# Altium project CAN_PDM.PrjPcb (part 1 of 2)
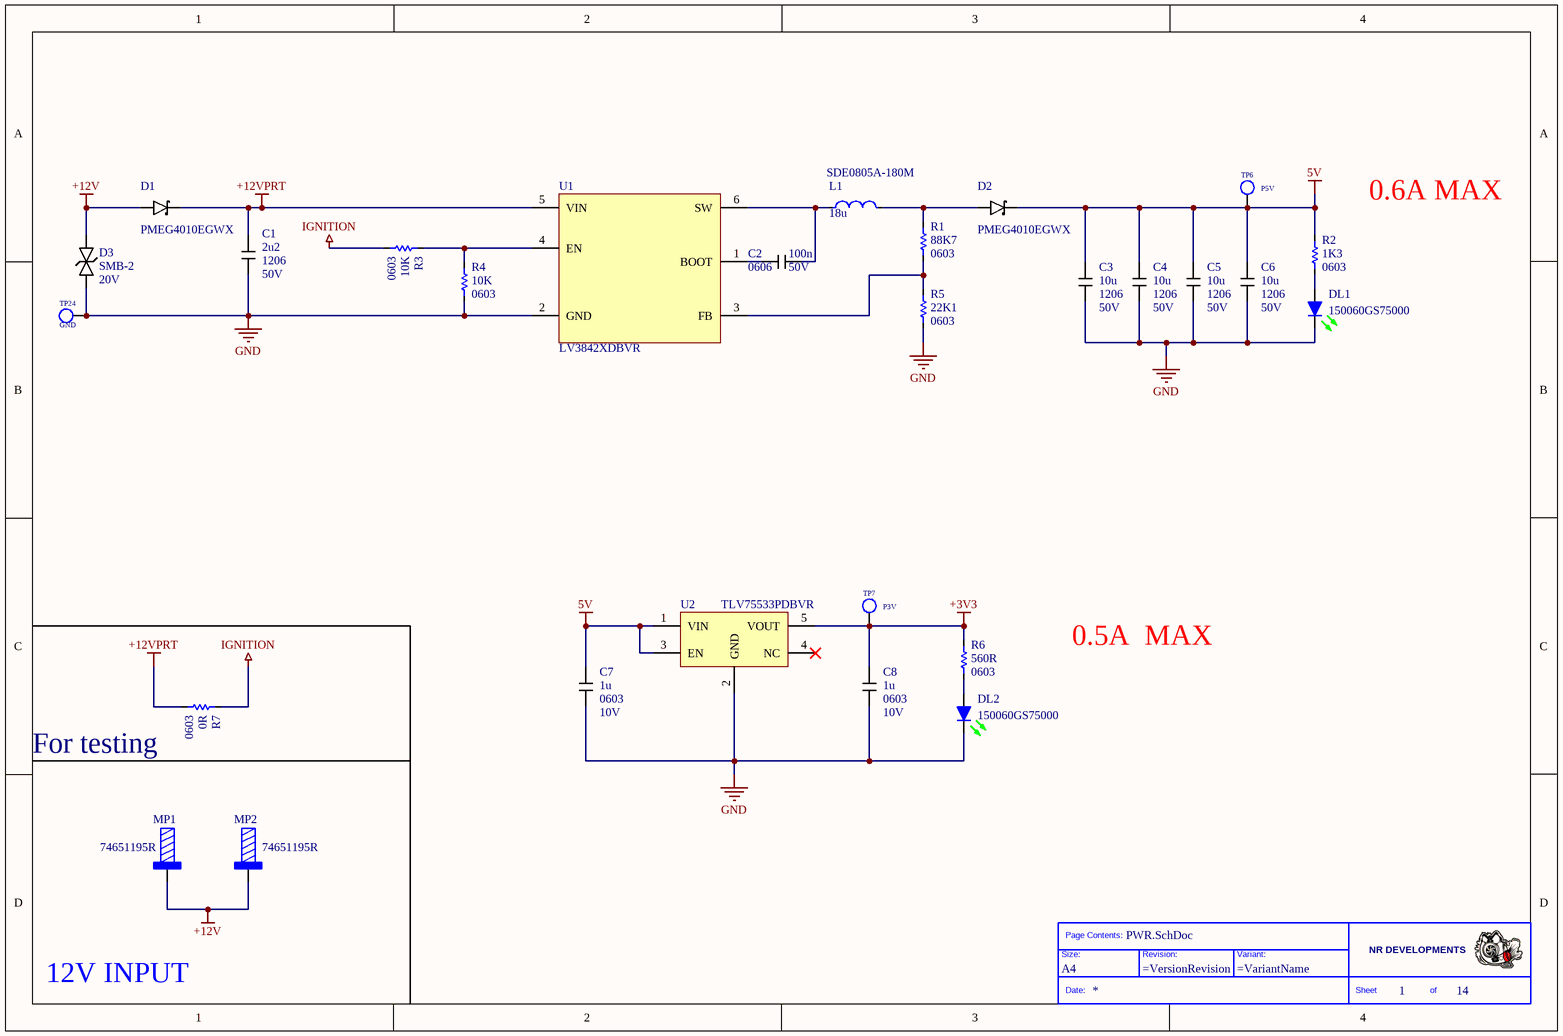
[diagram p0: PWR.SchDoc]
14 sheets, 327 parts. Net scope: flat (ports and power ports of the same name join across sheets).
Board file: CAN_PDM_Pcb.PcbDoc
Sheets:
  PWR.SchDoc
  MCU.SchDoc
  USB.SchDoc
  CAN.SchDoc
  HIGH_CURR_MOS.SchDoc
  HIGH_CURR_MOS2.SchDoc
  MID_CURR_MOS.SchDoc
  LOW_CURR_MOS.SchDoc
  SENSOR_INP.SchDoc
  DIGITAL_INP.SchDoc
  I2C.SchDoc
  LED_STATUS_OUTPUTS.SchDoc
  LED_STATUS_INPUT.SchDoc
  CONNECTOR.SchDoc

## Sheet PWR.SchDoc
size A4; SheetNumber: 1; SheetTotal: 14

### Parts
(Parts that share a designator on the sheet are numbered #1, #2 ... from top to bottom, then left to right.)
*#1  Size: A4  (hidden comment: Title_Block)  (graphical)
C1  value 2u2  Case: 1206  Voltage: 50V  [CAPC3216X16M]  (hidden comment: CAP)
C2  value 100n  Case: 0606  Voltage: 50V  [CAPC1608X09M]  (hidden comment: CAP)
C3  value 10u  Case: 1206  Voltage: 50V  [CAPC3216X16M]  (hidden comment: CAP)
C4  value 10u  Case: 1206  Voltage: 50V  [CAPC3216X16M]  (hidden comment: CAP)
C5  value 10u  Case: 1206  Voltage: 50V  [CAPC3216X16M]  (hidden comment: CAP)
C6  value 10u  Case: 1206  Voltage: 50V  [CAPC3216X16M]  (hidden comment: CAP)
C7  value 1u  Case: 0603  Voltage: 10V  [CAPC1608X09M]  (hidden comment: CAP)
C8  value 1u  Case: 0603  Voltage: 10V  [CAPC1608X09M]  (hidden comment: CAP)
D1  value PMEG4010EGWX  [SODFL360X130-2M -AC]  (hidden comment: Diode_Schottky)
D2  value PMEG4010EGWX  [SODFL360X130-2M -AC]  (hidden comment: Diode_Schottky)
D3  Case: SMB-2  Voltage: 20V  [ONSC-SMB-2]  (hidden comment: Diode)
DL1  value 150060GS75000  [LED0603]  (hidden comment: LED_Green)
DL2  value 150060GS75000  [LED0603]  (hidden comment: LED_Green)
L1  value 18u  PartNumber: SDE0805A-180M  [BOURNS_SDE0805A]  (hidden comment: IND)
MP1  value 74651195R  [WURTH_74651195]  (hidden comment: Connector)
MP2  value 74651195R  [WURTH_74651195]  (hidden comment: Connector)
R1  value 88K7  Case: 0603  [RESC1608X06M]  (hidden comment: Res)
R2  value 1K3  Case: 0603  [RESC1608X06M]  (hidden comment: Res)
R3  value 10K  Case: 0603  [RESC1608X06M]  (hidden comment: Res)
R4  value 10K  Case: 0603  [RESC1608X06M]  (hidden comment: Res)
R5  value 22K1  Case: 0603  [RESC1608X06M]  (hidden comment: Res)
R6  value 560R  Case: 0603  [RESC1608X06M]  (hidden comment: Res)
R7  value 0R  Case: 0603  [RESC1608X06M]  (hidden comment: Res)
TP6  P5V  [TP_c200]
TP7  P3V  [TP_c200]
TP24  GND  [TP_c200]
U1  value LV3842XDBVR  [SOT95P280X145-6N]  (hidden comment: DC DC)
U2  value TLV75533PDBVR  [SOT95P280X145-5N]  (hidden comment: TLV75530PDBVR)

### Nets
5V: C3.1 C4.1 C5.1 C6.1 C7.1 D2.C R2.2 TP6.1 U2.1(VIN) U2.3(EN)
+3V3: C8.1 R6.2 TP7.1 U2.5(VOUT)
+12V: D1.A D3.2 MP1.1 MP2.1
+12VPRT: C1.1 D1.C R7.1 U1.5(VIN)
GND: C1.2 C3.2 C4.2 C5.2 C6.2 C7.2 C8.2 D3.1 DL1.C DL2.C R4.1 R5.1 TP24.1 U1.2(GND) U2.2(GND)
IGNITION: R3.1 R7.2
NetC2_1: C2.1 U1.1(BOOT)
NetC2_2: C2.2 L1.1 U1.6(SW)
NetD2_A: D2.A L1.2 R1.2
NetDL1_A: DL1.A R2.1
NetDL2_A: DL2.A R6.1
NetR1_1: R1.1 R5.2 U1.3(FB)
NetR3_2: R3.2 R4.2 U1.4(EN)

Not connected (* = marked no-connect by the designer): U2 4(NC)*

### Notes on the sheet
- 0.6A MAX
- 0.5A  MAX
- (near R7) For testing
- 12V INPUT
- (in symbol Title_Block) Page Contents:; NR DEVELOPMENTS; Size:; Revision:; Variant:; Date:; Sheet; of

### Library data of the parts
C1 = CAP: Manufacturer: KEMET; PartNumber: C1206C225K5RAC
C2 = CAP: Manufacturer: KEMET; PartNumber: C0603C104K5RACTU
C3-C6 = CAP: Manufacturer: Samsung Electro-Mechanics; PartNumber: CL31B106KBHNNNE
C7 C8 = CAP: Manufacturer: KEMET; PartNumber: C0603C105K8RACTU
D1 D2 = Diode_Schottky: Manufacturer: Nexperia; PartNumber: PMEG4010EGWX; Case: SOD123
D3 = Diode_TVS_Bid: Manufacturer: Littelfuse; Value: SZ1SMB20CAT3G; PartNumber: SZ1SMB20CAT3G
DL1 DL2 = LED_Green: Manufacturer: Wurth Elektronik; Case: 0603; PartNumber: 150060GS75000
L1 = IND: Manufacturer: BOURNS; Case: SDE0805A
MP1 MP2 = 74651195R: Manufacturer: Wurth Electronics; PartNumber: 74651195R
R1 = Resistor: Manufacturer: Vishay; PartNumber: CRCW060388K7FKEAC
R2 = Resistor: Manufacturer: Vishay; PartNumber: RC0603FR-071K3L
R3 R4 = Resistor: Manufacturer: YAGEO; PartNumber: AC0603FR-0710KL
R5 = Resistor: Manufacturer: Vishay; PartNumber: CRCW060322K1FKEA
R6 = Resistor: Manufacturer: Vishay; PartNumber: RC0603FR-07560RL
R7 = Resistor: Manufacturer: YAGEO; PartNumber: RC0603JR-070RL
TP6 TP7 TP24 = Test_Point
U1 = LV3842XDBVR: 4-V to 36-V, 600-mA synchronous step-down converter; Manufacturer: Texas Instruments; PartNumber: LV3842XDBVR; Case: 6-SOT-23
U2 = TLV75530PDBVR: LDO Voltage Regulators 500-mA high-PSRR low-IQ low-dropout voltage regulator with enable; Manufacturer: Texas Instruments; PartNumber: TLV75533PDBVR; Case: SOT-23-5

## Sheet MCU.SchDoc
size A4; SheetNumber: 2; SheetTotal: 14
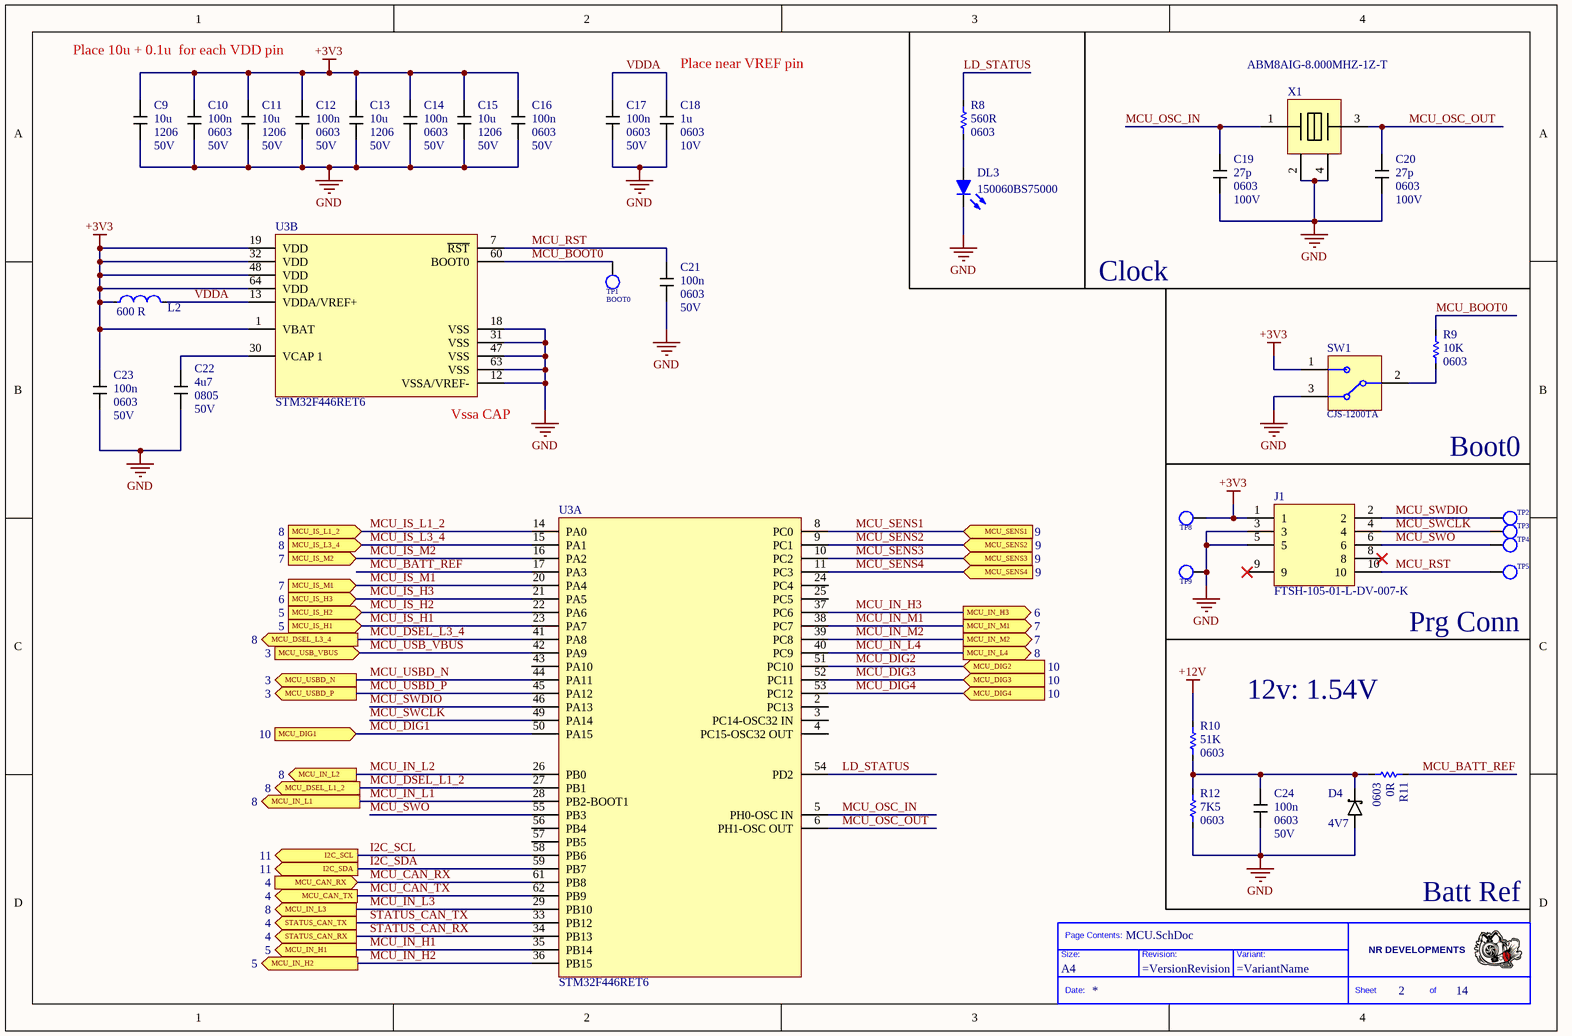
[diagram p1: MCU.SchDoc]

### Parts
(Parts that share a designator on the sheet are numbered #1, #2 ... from top to bottom, then left to right.)
*#2  Size: A4  (hidden comment: Title_Block)  (graphical)
C9  value 10u  Case: 1206  Voltage: 50V  [CAPC3216X16M]  (hidden comment: CAP)
C10  value 100n  Case: 0603  Voltage: 50V  [CAPC1608X09M]  (hidden comment: CAP)
C11  value 10u  Case: 1206  Voltage: 50V  [CAPC3216X16M]  (hidden comment: CAP)
C12  value 100n  Case: 0603  Voltage: 50V  [CAPC1608X09M]  (hidden comment: CAP)
C13  value 10u  Case: 1206  Voltage: 50V  [CAPC3216X16M]  (hidden comment: CAP)
C14  value 100n  Case: 0603  Voltage: 50V  [CAPC1608X09M]  (hidden comment: CAP)
C15  value 10u  Case: 1206  Voltage: 50V  [CAPC3216X16M]  (hidden comment: CAP)
C16  value 100n  Case: 0603  Voltage: 50V  [CAPC1608X09M]  (hidden comment: CAP)
C17  value 100n  Case: 0603  Voltage: 50V  [CAPC1608X09M]  (hidden comment: CAP)
C18  value 1u  Case: 0603  Voltage: 10V  [CAPC1608X09M]  (hidden comment: CAP)
C19  value 27p  Case: 0603  Voltage: 100V  [CAPC1608X09M]  (hidden comment: CAP)
C20  value 27p  Case: 0603  Voltage: 100V  [CAPC1608X09M]  (hidden comment: CAP)
C21  value 100n  Case: 0603  Voltage: 50V  [CAPC1608X09M]  (hidden comment: CAP)
C22  value 4u7  Case: 0805  Voltage: 50V  [CAPC2012X14N]  (hidden comment: CAP)
C23  value 100n  Case: 0603  Voltage: 50V  [CAPC1608X09M]  (hidden comment: CAP)
C24  value 100n  Case: 0603  Voltage: 50V  [CAPC1608X09M]  (hidden comment: CAP)
D4  value 4V7  [SOT65P210X100-3N - AC]  (hidden comment: Diode_Schottky)
DL3  value 150060BS75000  [LED0603]  (hidden comment: Led_Green)
J1  value FTSH-105-01-L-DV-007-K  [SAMTEC_FTSH-105-X-X-DV-007-P-X]  (hidden comment: Connector)
L2  value 600 R  [INDC1608X09N]  (hidden comment: IND)
R8  value 560R  Case: 0603  [RESC1608X06M]  (hidden comment: Res)
R9  value 10K  Case: 0603  [RESC1608X06M]  (hidden comment: Res)
R10  value 51K  Case: 0603  [RESC1608X06M]  (hidden comment: Res)
R11  value 0R  Case: 0603  [RESC1608X06M]  (hidden comment: Res)
R12  value 7K5  Case: 0603  [RESC1608X06M]  (hidden comment: Res)
SW1  value CJS-1200TA  [SW_CJS-1200TA]  (hidden comment: Switch SPDT)
TP1  BOOT0  [TP_c200]
TP2  DIO  [TP_c200]  (value not drawn)
TP3  CLK  [TP_c200]  (value not drawn)
TP4  SWO  [TP_c200]  (value not drawn)
TP5  RST  [TP_c200]  (value not drawn)
TP8  3V3  [TP_c200]  (value not drawn)
TP9  GND  [TP_c200]  (value not drawn)
U3  STM32F446RET6  [STM-LQFP64_M]  (parts A,B of 2)
X1  ABM8AIG-8.000MHZ-1Z-T  [ABM8G_abracon]

### Ports
I2C_SCL (out, see 11), I2C_SDA (out, see 11), MCU_CAN_RX (in, see 4), MCU_CAN_TX (out, see 4), MCU_DIG1 (in, see 10), MCU_DIG2 (in, see 10), MCU_DIG3 (in, see 10), MCU_DIG4 (in, see 10), MCU_DSEL_L1_2 (out, see 8), MCU_DSEL_L3_4 (out, see 8), MCU_IN_H1 (out, see 5), MCU_IN_H2 (out, see 5), MCU_IN_H3 (out, see 6), MCU_IN_L1 (out, see 8), MCU_IN_L2 (out, see 8), MCU_IN_L3 (out, see 8), MCU_IN_L4 (out, see 8), MCU_IN_M1 (out, see 7), MCU_IN_M2 (out, see 7), MCU_IS_H1 (in, see 5), MCU_IS_H2 (in, see 5), MCU_IS_H3 (in, see 6), MCU_IS_L1_2 (in, see 8), MCU_IS_L3_4 (in, see 8), MCU_IS_M1 (in, see 7), MCU_IS_M2 (in, see 7), MCU_SENS1 (in, see 9), MCU_SENS2 (in, see 9), MCU_SENS3 (in, see 9), MCU_SENS4 (in, see 9), MCU_USB_VBUS (in, see 3), MCU_USBD_N (out, see 3), MCU_USBD_P (out, see 3), STATUS_CAN_RX (out, see 4), STATUS_CAN_TX (out, see 4)

### Nets
+3V3: C9.1 C10.1 C11.1 C12.1 C13.1 C14.1 C15.1 C16.1 C23.1 J1.1 L2.1 SW1.1 TP8.1 U3.1(VBAT) U3.19(VDD) U3.32(VDD) U3.48(VDD) U3.64(VDD)
+12V: R10.2
GND: C9.2 C10.2 C11.2 C12.2 C13.2 C14.2 C15.2 C16.2 C17.2 C18.2 C19.2 C20.2 C21.2 C22.2 C23.2 C24.2 D4.A DL3.C J1.3 J1.5 R12.1 SW1.3 TP9.1 U3.12(VSSA/VREF-) U3.18(VSS) U3.31(VSS) U3.47(VSS) U3.63(VSS) X1.2 X1.4
I2C_SCL: U3.58(PB6) ; port I2C_SCL
I2C_SDA: U3.59(PB7) ; port I2C_SDA
LD_STATUS: R8.2 U3.54(PD2)
MCU_BATT_REF: R11.2 U3.17(PA3)
MCU_BOOT0: R9.2 TP1.1 U3.60(BOOT0)
MCU_CAN_RX: U3.61(PB8) ; port MCU_CAN_RX
MCU_CAN_TX: U3.62(PB9) ; port MCU_CAN_TX
MCU_DIG1: U3.50(PA15) ; port MCU_DIG1
MCU_DIG2: U3.51(PC10) ; port MCU_DIG2
MCU_DIG3: U3.52(PC11) ; port MCU_DIG3
MCU_DIG4: U3.53(PC12) ; port MCU_DIG4
MCU_DSEL_L1_2: U3.27(PB1) ; port MCU_DSEL_L1_2
MCU_DSEL_L3_4: U3.41(PA8) ; port MCU_DSEL_L3_4
MCU_IN_H1: U3.35(PB14) ; port MCU_IN_H1
MCU_IN_H2: U3.36(PB15) ; port MCU_IN_H2
MCU_IN_H3: U3.37(PC6) ; port MCU_IN_H3
MCU_IN_L1: U3.28(PB2-BOOT1) ; port MCU_IN_L1
MCU_IN_L2: U3.26(PB0) ; port MCU_IN_L2
MCU_IN_L3: U3.29(PB10) ; port MCU_IN_L3
MCU_IN_L4: U3.40(PC9) ; port MCU_IN_L4
MCU_IN_M1: U3.38(PC7) ; port MCU_IN_M1
MCU_IN_M2: U3.39(PC8) ; port MCU_IN_M2
MCU_IS_H1: U3.23(PA7) ; port MCU_IS_H1
MCU_IS_H2: U3.22(PA6) ; port MCU_IS_H2
MCU_IS_H3: U3.21(PA5) ; port MCU_IS_H3
MCU_IS_L1_2: U3.14(PA0) ; port MCU_IS_L1_2
MCU_IS_L3_4: U3.15(PA1) ; port MCU_IS_L3_4
MCU_IS_M1: U3.20(PA4) ; port MCU_IS_M1
MCU_IS_M2: U3.16(PA2) ; port MCU_IS_M2
MCU_OSC_IN: C19.1 U3.5(PH0-OSC_IN) X1.1
MCU_OSC_OUT: C20.1 U3.6(PH1-OSC_OUT) X1.3
MCU_RST: C21.1 J1.10 TP5.1 U3.7(~{RST})
MCU_SENS1: U3.8(PC0) ; port MCU_SENS1
MCU_SENS2: U3.9(PC1) ; port MCU_SENS2
MCU_SENS3: U3.10(PC2) ; port MCU_SENS3
MCU_SENS4: U3.11(PC3) ; port MCU_SENS4
MCU_SWCLK: J1.4 TP3.1 U3.49(PA14)
MCU_SWDIO: J1.2 TP2.1 U3.46(PA13)
MCU_SWO: J1.6 TP4.1 U3.55(PB3)
MCU_USB_VBUS: U3.42(PA9) ; port MCU_USB_VBUS
MCU_USBD_N: U3.44(PA11) ; port MCU_USBD_N
MCU_USBD_P: U3.45(PA12) ; port MCU_USBD_P
STATUS_CAN_RX: U3.34(PB13) ; port STATUS_CAN_RX
STATUS_CAN_TX: U3.33(PB12) ; port STATUS_CAN_TX
VDDA: C17.1 C18.1 L2.2 U3.13(VDDA/VREF+)
NetC22_1: C22.1 U3.30(VCAP_1)
NetC24_1: C24.1 D4.C R10.1 R11.1 R12.2
NetDL3_A: DL3.A R8.1
NetR9_1: R9.1 SW1.2

Not connected (* = marked no-connect by the designer): J1 8* 9*; U3 2(PC13) 3(PC14-OSC32_IN) 4(PC15-OSC32_OUT) 24(PC4) 25(PC5) 43(PA10) 56(PB4) 57(PB5)

### Notes on the sheet
- Place 10u + 0.1u  for each VDD pin
- (near C18) Place near VREF pin
- Clock
- (near U3) Vssa CAP
- Boot0
- (near TP5) Prg Conn
- 12v: 1.54V
- Batt Ref
- (in symbol Title_Block) Page Contents:; NR DEVELOPMENTS; Size:; Revision:; Variant:; Date:; Sheet; of

### Library data of the parts
C9 C11 C13 C15 = CAP: as C3 on sheet PWR
C10 C12 C14 C16 C17 C21 C23 C24 = CAP: as C2 on sheet PWR
C18 = CAP: as C7 on sheet PWR
C19 C20 = CAP: Manufacturer: YAGEO; PartNumber: CC0603FRNPO0BN270
C22 = CAP: Manufacturer: KEMET; PartNumber: C1206C475K5RACTU
D4 = Diode_Schottky: Manufacturer: Nexperia; PartNumber: BZX84W-C4V7-QX; Case: SOT323
DL3 = LED_Blue: Manufacturer: Wurth Elektronik; Case: 0603; PartNumber: 150060BS75000
J1 = FTSH-105-X-X-DV-007-P-X: Manufacturer: Samtech; PartNumber: FTSH-105-01-L-DV-007-K
L2 = IND: Manufacturer: TDK; PartNumber: MMZ1608R601ATD25; Case: 0603
R8 = Resistor: as R6 on sheet PWR
R9 = Resistor: as R3 on sheet PWR
R10 = Resistor: Manufacturer: Vishay; PartNumber: CRCW060351K0FKEA
R11 = Resistor: as R7 on sheet PWR
R12 = Resistor: Manufacturer: Vishay; PartNumber: CRCW06037K50FKEA
SW1 = SWITCH_SPDT: Manufacturer: Nidec Components; PartNumber: CJS-1200TA
TP1-TP5 TP8 TP9 = Test_Point
U3 = STM32F446RET6: IC MCU 32BIT 512KB FLASH 64LQFP; Manufacturer: ST; PartNumber: STM32F446RET6
X1 = Crystal: Manufacturer: Abracom; Value: ABM8AIG-8.000MHZ-1Z-T; PartNumber: ABM8AIG-8.000MHZ-1Z-T

## Sheet USB.SchDoc
size A4; SheetNumber: 3; SheetTotal: 14
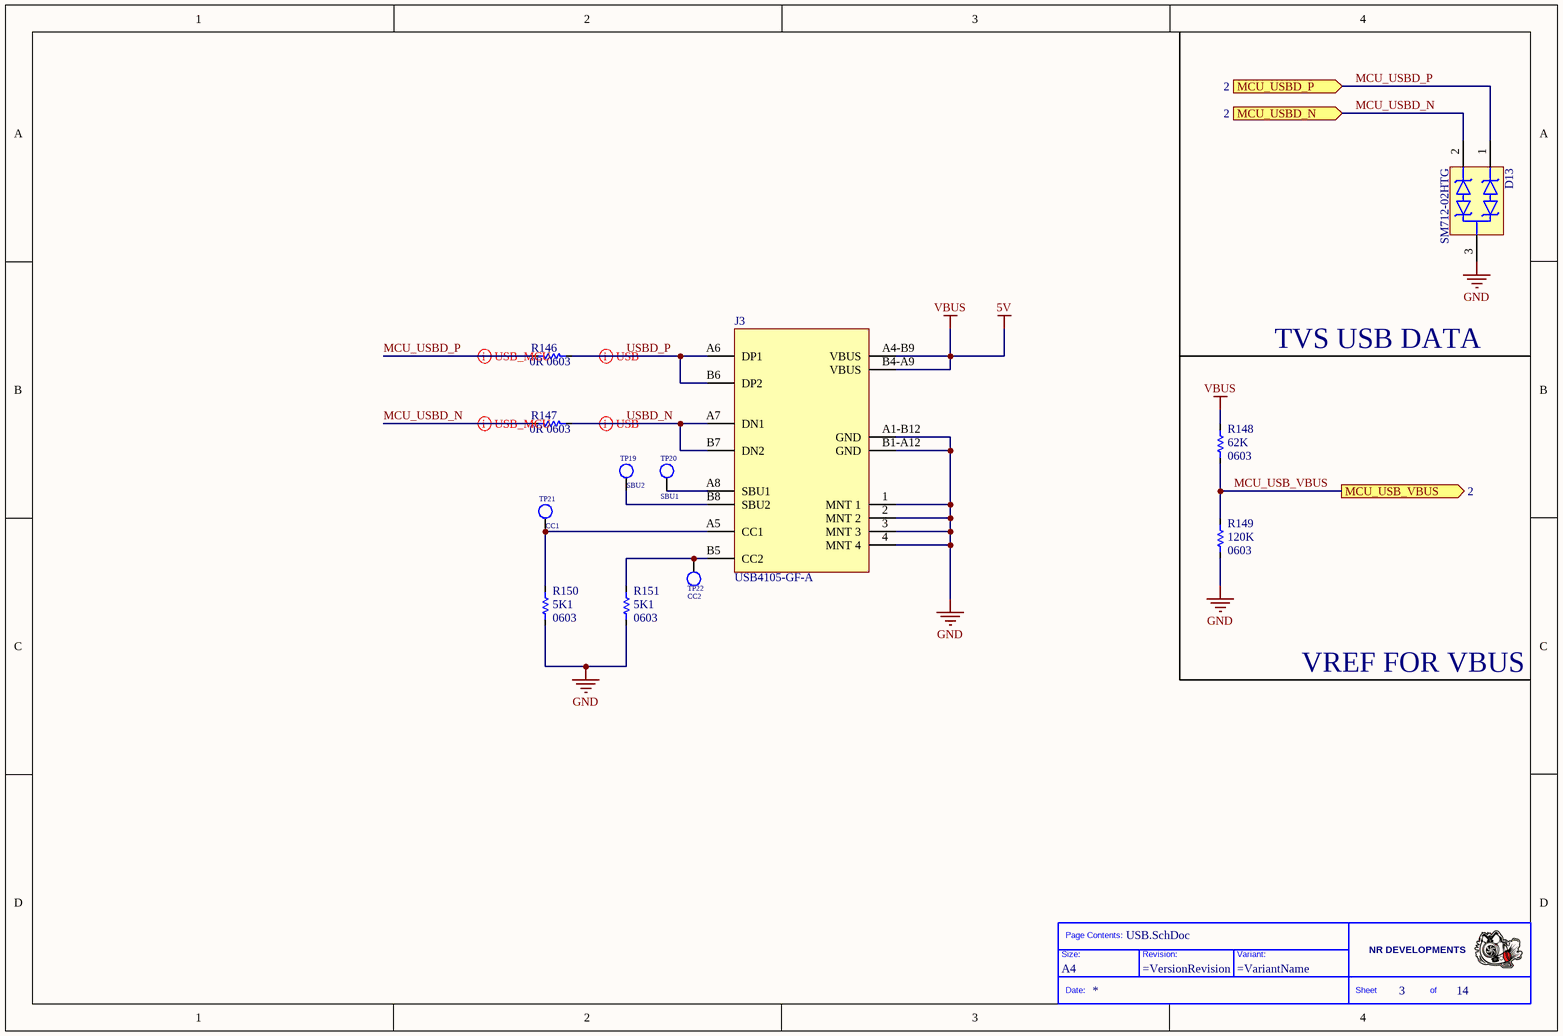
[diagram p2: USB.SchDoc]

### Parts
(Parts that share a designator on the sheet are numbered #1, #2 ... from top to bottom, then left to right.)
*#3  Size: A4  (hidden comment: Title_Block)  (graphical)
D13  SM712-02HTG  [SOT95P240X120-3N]
J3  USB4105-GF-A  [GCT-USB4105-GF-A]
R146  value 0R  Case: 0603  [RESC1608X06M]  (hidden comment: CRCW06030000Z0EAC)
R147  value 0R  Case: 0603  [RESC1608X06M]  (hidden comment: CRCW06030000Z0EAC)
R148  value 62K  Case: 0603  [RESC1608X06M]
R149  value 120K  Case: 0603  [RESC1608X06M]
R150  value 5K1  Case: 0603  [RESC1608X06M]  (hidden comment: Resistor)
R151  value 5K1  Case: 0603  [RESC1608X06M]  (hidden comment: Resistor)
TP19  SBU2  [TP_c200]
TP20  SBU1  [TP_c200]
TP21  CC1  [TP_c200]
TP22  CC2  [TP_c200]

### Ports
MCU_USB_VBUS (out, see 2), MCU_USBD_N (in, see 2), MCU_USBD_P (in, see 2)

### Nets
5V: J3.A4-B9(VBUS) J3.B4-A9(VBUS) R148.2  [also labelled VBUS]
GND: D13.3 J3.1(MNT_1) J3.2(MNT_2) J3.3(MNT_3) J3.4(MNT_4) J3.A1-B12(GND) J3.B1-A12(GND) R149.1 R150.1 R151.1
MCU_USB_VBUS: R148.1 R149.2 ; port MCU_USB_VBUS
MCU_USBD_N: D13.2 R147.1 ; port MCU_USBD_N
MCU_USBD_P: D13.1 R146.1 ; port MCU_USBD_P
USBD_N: J3.A7(DN1) J3.B7(DN2) R147.2
USBD_P: J3.A6(DP1) J3.B6(DP2) R146.2
NetJ3_A5: J3.A5(CC1) R150.2 TP21.1
NetJ3_A8: J3.A8(SBU1) TP20.1
NetJ3_B5: J3.B5(CC2) R151.2 TP22.1
NetJ3_B8: J3.B8(SBU2) TP19.1

### Layout directives
differential pair: MCU_USBD_N, MCU_USBD_P, USBD_N, USBD_P

### Notes on the sheet
- TVS USB DATA
- VREF FOR VBUS
- (in symbol Title_Block) Page Contents:; NR DEVELOPMENTS; Size:; Revision:; Variant:; Date:; Sheet; of

### Library data of the parts
D13 = SM712-02HTG: ESD Diode bid -7 to 12v; Manufacturer: Littelfuse; PartNumber: SM712-02HTG; Case: SOT23-3; Value: SM712-02HTG
J3 = USB4105-GF-A: USB Connectors USB Type C,2.0, Rec,SMT, 0.95mmTH Shell Stakes,G/F,RA,Top Mnt,T&R; Manufacturer: GCT; PartNumber: USB4105-GF-A; Value: USB4105-GF-A; Case: USB-C
R146 R147 = Resistor: as R7 on sheet PWR
R148-R151 = Resistor: Manufacturer: Vishay; PartNumber: CRCW06035K10FKEC
TP19-TP22 = Test_Point: Test Poin

## Sheet CAN.SchDoc
size A4; SheetNumber: 4; SheetTotal: 14
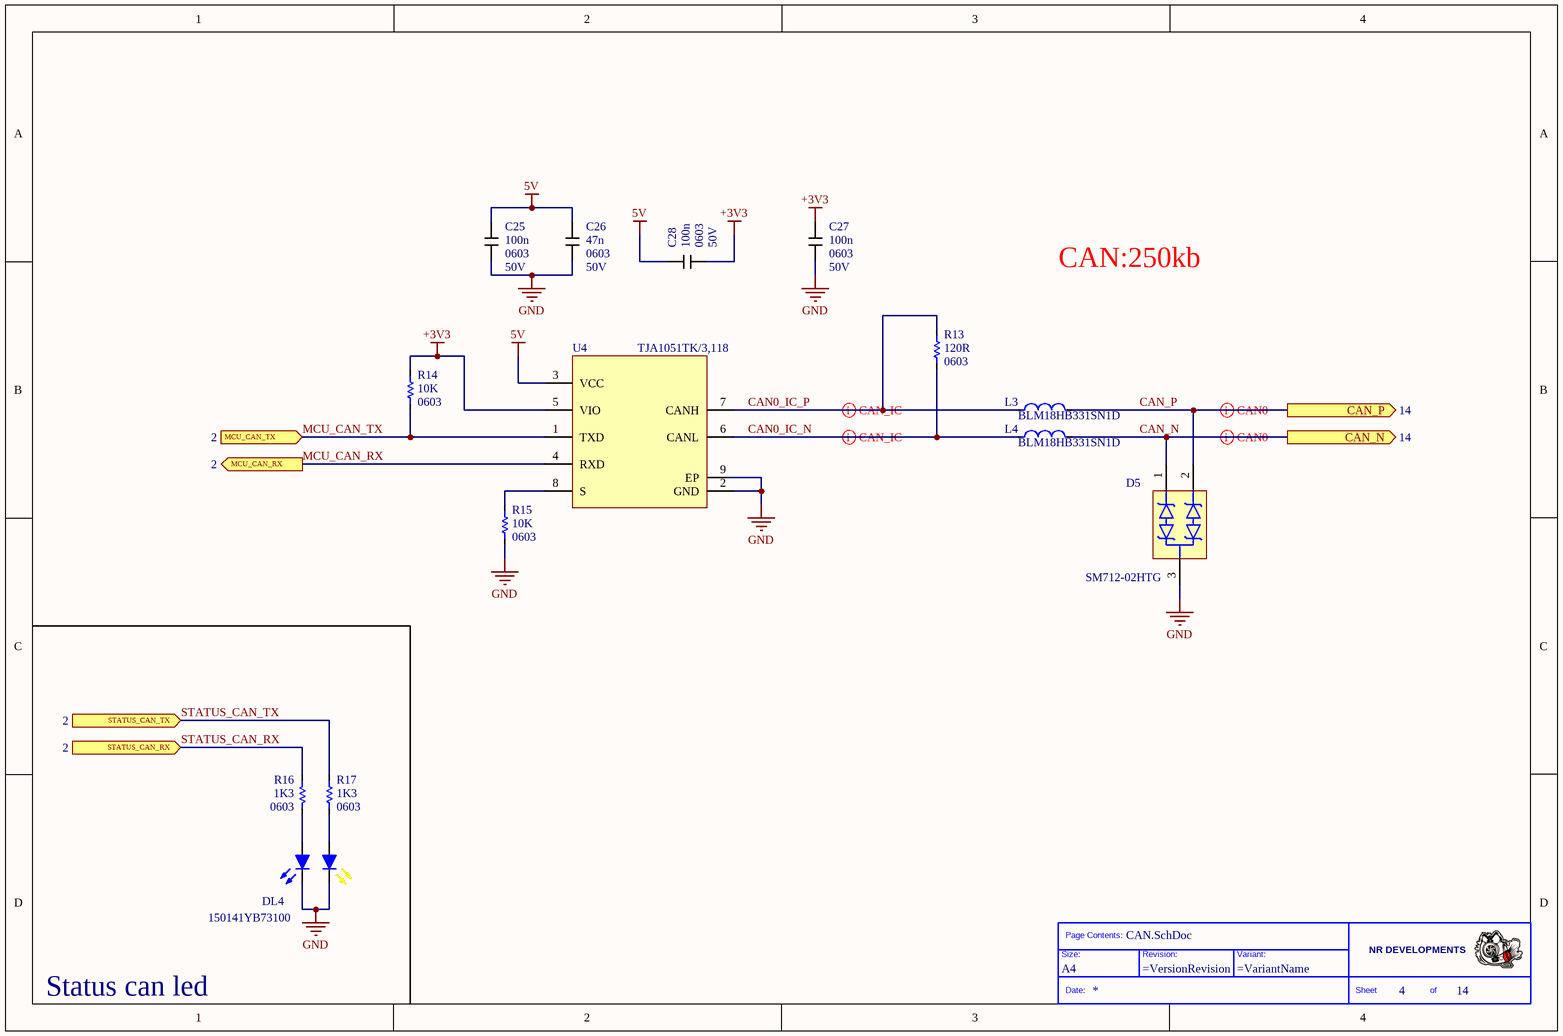
[diagram p3: CAN.SchDoc]

### Parts
(Parts that share a designator on the sheet are numbered #1, #2 ... from top to bottom, then left to right.)
*#4  Size: A4  (hidden comment: Title_Block)  (graphical)
C25  value 100n  Case: 0603  Voltage: 50V  [CAPC1608X09M]  (hidden comment: CAP)
C26  value 47n  Case: 0603  Voltage: 50V  [CAPC1608X09M]  (hidden comment: CAP)
C27  value 100n  Case: 0603  Voltage: 50V  [CAPC1608X09M]  (hidden comment: CAP)
C28  value 100n  Case: 0603  Voltage: 50V  [CAPC1608X09M]  (hidden comment: CAP)
D5  value SM712-02HTG  [SOT95P240X120-3N]  (hidden comment: ESD_Diode)
DL4  value 150141YB73100  [WURTH-SBTW_3528]  (hidden comment: LED_Yellow_Blue)
L3  value BLM18HB331SN1D  [INDC1608X09N]  (hidden comment: IND)
L4  value BLM18HB331SN1D  [INDC1608X09N]  (hidden comment: IND)
R13  value 120R  Case: 0603  [RESC1608X06M]  (hidden comment: Res)
R14  value 10K  Case: 0603  [RESC1608X06M]  (hidden comment: Res)
R15  value 10K  Case: 0603  [RESC1608X06M]  (hidden comment: Res)
R16  value 1K3  Case: 0603  [RESC1608X06M]  (hidden comment: Res)
R17  value 1K3  Case: 0603  [RESC1608X06M]  (hidden comment: Res)
U4  TJA1051TK/3,118  [SON65P300X300X100-9N-D]

### Ports
CAN_N (out, see 14), CAN_P (out, see 14), MCU_CAN_RX (out, see 2), MCU_CAN_TX (in, see 2), STATUS_CAN_RX (in, see 2), STATUS_CAN_TX (in, see 2)

### Nets
5V: C25.1 C26.1 C28.1 U4.3(VCC)
+3V3: C27.1 C28.2 R14.2 U4.5(VIO)
GND: C25.2 C26.2 C27.2 D5.3 DL4.C1 DL4.C2 R15.1 U4.2(GND) U4.9(EP)
CAN0_IC_N: L4.1 R13.1 U4.6(CANL)
CAN0_IC_P: L3.1 R13.2 U4.7(CANH)
CAN_N: D5.1 L4.2 ; port CAN_N
CAN_P: D5.2 L3.2 ; port CAN_P
MCU_CAN_RX: U4.4(RXD) ; port MCU_CAN_RX
MCU_CAN_TX: R14.1 U4.1(TXD) ; port MCU_CAN_TX
STATUS_CAN_RX: R16.2 ; port STATUS_CAN_RX
STATUS_CAN_TX: R17.2 ; port STATUS_CAN_TX
NetDL4_A1: DL4.A1 R17.1
NetDL4_A2: DL4.A2 R16.1
NetR15_2: R15.2 U4.8(S)

### Layout directives
differential pair: CAN0_IC_N, CAN0_IC_P, CAN_N, CAN_P

### Notes on the sheet
- CAN:250kb
- Status can led
- (in symbol Title_Block) Page Contents:; NR DEVELOPMENTS; Size:; Revision:; Variant:; Date:; Sheet; of

### Library data of the parts
C25 C27 C28 = CAP: as C2 on sheet PWR
C26 = CAP: Manufacturer: YAGEO; PartNumber: CC0603KRX7R9BB473
D5 = SM712-02HTG: ESD Diode bid; Manufacturer: Littelfuse; Case: SOT23-3; PartNumber: SM712-02HTG
DL4 = LED_Yellow_Blue: Led Yellow - Blue 3528; Manufacturer: Wurth; PartNumber: 150141YB73100; Case: 3528
L3 L4 = IND: Manufacturer: Murata; Case: 0603; PartNumber: BLM18HB331SN1D
R13 = Resistor: Manufacturer: Vishay; PartNumber: CRCW0603120RFKEA
R14 R15 = Resistor: as R3 on sheet PWR
R16 R17 = Resistor: as R2 on sheet PWR
U4 = TJA1051TK/3: CAN HIGH-SPEED CAN TRANSCEIVER 3.3V / 5V Pin VIO; Manufacturer: NXP Semiconductors; Value: TJA1051TK/3,118; Case: HVSON-8; PartNumber: TJA1051TK/3,118

## Sheet HIGH_CURR_MOS.SchDoc
size A4; SheetNumber: 5; SheetTotal: 14
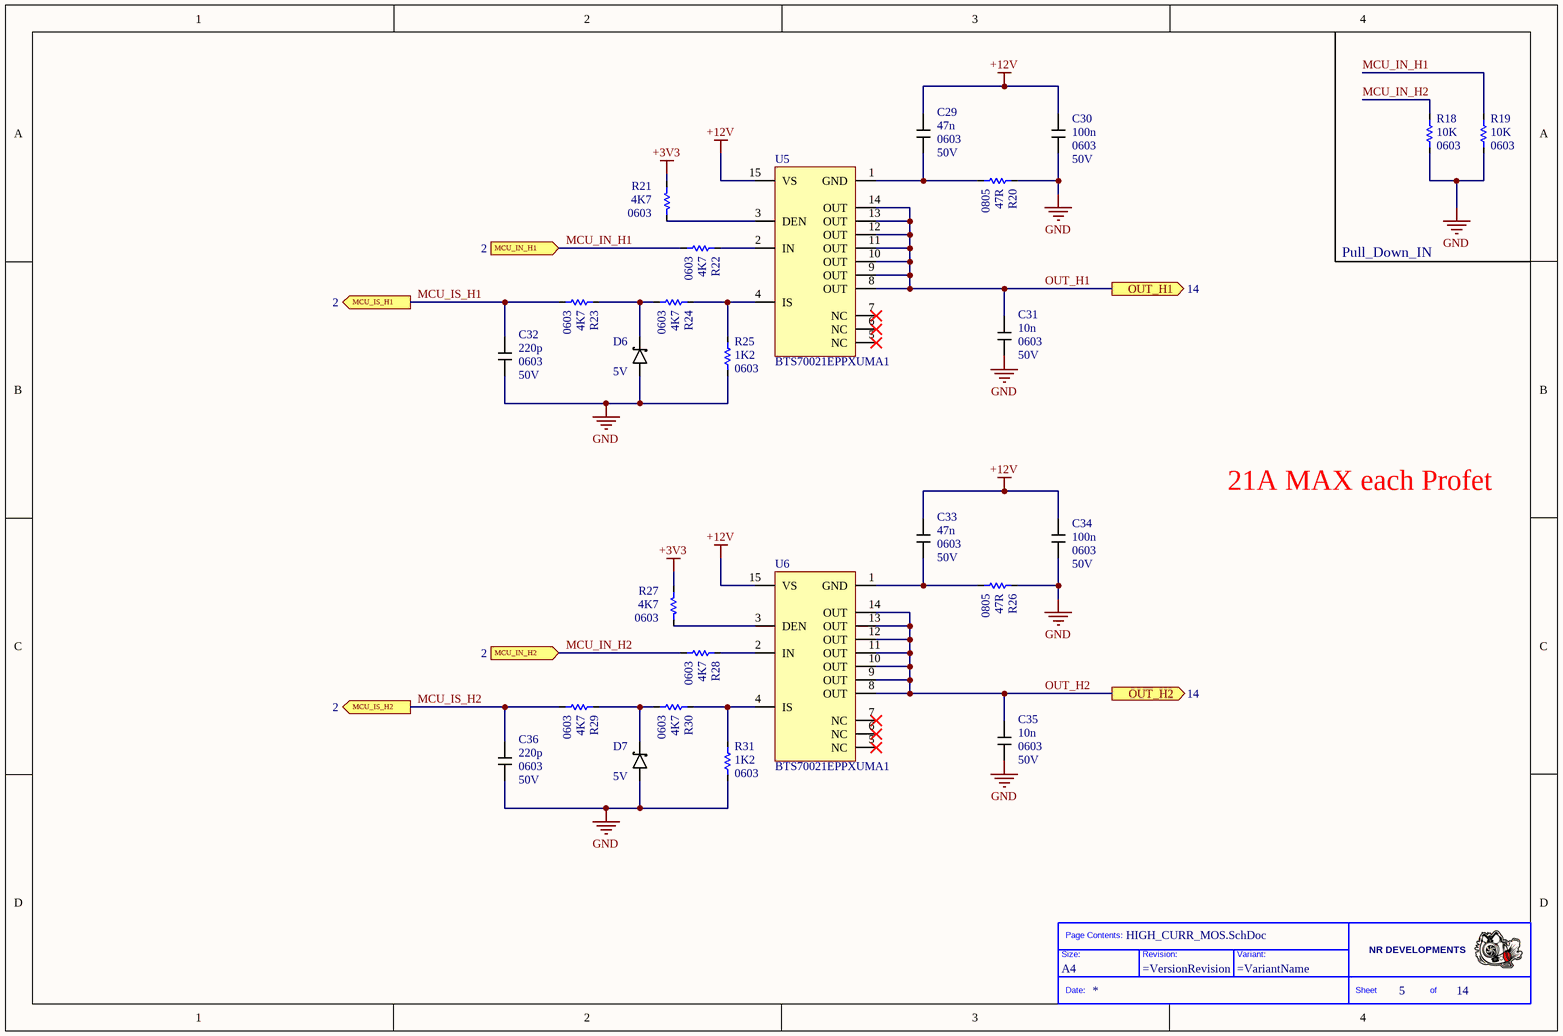
[diagram p4: HIGH_CURR_MOS.SchDoc]

### Parts
(Parts that share a designator on the sheet are numbered #1, #2 ... from top to bottom, then left to right.)
*#5  Size: A4  (hidden comment: Title_Block)  (graphical)
C29  value 47n  Case: 0603  Voltage: 50V  [CAPC1608X09M]  (hidden comment: CAP)
C30  value 100n  Case: 0603  Voltage: 50V  [CAPC1608X09M]  (hidden comment: CAP)
C31  value 10n  Case: 0603  Voltage: 50V  [CAPC1608X09M]  (hidden comment: CAP)
C32  value 220p  Case: 0603  Voltage: 50V  [CAPC1608X09M]  (hidden comment: CAP)
C33  value 47n  Case: 0603  Voltage: 50V  [CAPC1608X09M]  (hidden comment: CAP)
C34  value 100n  Case: 0603  Voltage: 50V  [CAPC1608X09M]  (hidden comment: CAP)
C35  value 10n  Case: 0603  Voltage: 50V  [CAPC1608X09M]  (hidden comment: CAP)
C36  value 220p  Case: 0603  Voltage: 50V  [CAPC1608X09M]  (hidden comment: CAP)
D6  value 5V  [SOT65P210X100-3N - AC]  (hidden comment: Diode_Schottky)
D7  value 5V  [SOT65P210X100-3N - AC]  (hidden comment: Diode_Schottky)
R18  value 10K  Case: 0603  [RESC1608X06M]  (hidden comment: Res)
R19  value 10K  Case: 0603  [RESC1608X06M]  (hidden comment: Res)
R20  value 47R  Case: 0805  [RESC2012X06N]  (hidden comment: Res)
R21  value 4K7  Case: 0603  [RESC1608X06M]  (hidden comment: Res)
R22  value 4K7  Case: 0603  [RESC1608X06M]  (hidden comment: Res)
R23  value 4K7  Case: 0603  [RESC1608X06M]  (hidden comment: Res)
R24  value 4K7  Case: 0603  [RESC1608X06M]  (hidden comment: Res)
R25  value 1K2  Case: 0603  [RESC1608X06M]  (hidden comment: Res)
R26  value 47R  Case: 0805  [RESC2012X06N]  (hidden comment: Res)
R27  value 4K7  Case: 0603  [RESC1608X06M]  (hidden comment: Res)
R28  value 4K7  Case: 0603  [RESC1608X06M]  (hidden comment: Res)
R29  value 4K7  Case: 0603  [RESC1608X06M]  (hidden comment: Res)
R30  value 4K7  Case: 0603  [RESC1608X06M]  (hidden comment: Res)
R31  value 1K2  Case: 0603  [RESC1608X06M]  (hidden comment: Res)
U5  value BTS70021EPPXUMA1  [SOP65P600X115-15]  (hidden comment: BTS7002-1EPP)
U6  value BTS70021EPPXUMA1  [SOP65P600X115-15]  (hidden comment: BTS7002-1EPP)

### Ports
MCU_IN_H1 (in, see 2), MCU_IN_H2 (in, see 2), MCU_IS_H1 (out, see 2), MCU_IS_H2 (out, see 2), OUT_H1 (out, see 14), OUT_H2 (out, see 14)

### Nets
+3V3: R21.2 R27.2
+12V: C29.1 C30.1 C33.1 C34.1 U5.15(VS) U6.15(VS)
GND: C30.2 C31.2 C32.2 C34.2 C35.2 C36.2 D6.A D7.A R18.1 R19.1 R20.2 R25.1 R26.2 R31.1
MCU_IN_H1: R19.2 R22.1 ; port MCU_IN_H1
MCU_IN_H2: R18.2 R28.1 ; port MCU_IN_H2
MCU_IS_H1: C32.1 R23.1 ; port MCU_IS_H1
MCU_IS_H2: C36.1 R29.1 ; port MCU_IS_H2
OUT_H1: C31.1 U5.8(OUT) U5.9(OUT) U5.10(OUT) U5.11(OUT) U5.12(OUT) U5.13(OUT) U5.14(OUT) ; port OUT_H1
OUT_H2: C35.1 U6.8(OUT) U6.9(OUT) U6.10(OUT) U6.11(OUT) U6.12(OUT) U6.13(OUT) U6.14(OUT) ; port OUT_H2
NetC29_2: C29.2 R20.1 U5.1(GND)
NetC33_2: C33.2 R26.1 U6.1(GND)
NetD6_C: D6.C R23.2 R24.1
NetD7_C: D7.C R29.2 R30.1
NetR21_1: R21.1 U5.3(DEN)
NetR22_2: R22.2 U5.2(IN)
NetR24_2: R24.2 R25.2 U5.4(IS)
NetR27_1: R27.1 U6.3(DEN)
NetR28_2: R28.2 U6.2(IN)
NetR30_2: R30.2 R31.2 U6.4(IS)

Not connected (* = marked no-connect by the designer): U5 5(NC)* 6(NC)* 7(NC)*; U6 5(NC)* 6(NC)* 7(NC)*

### Notes on the sheet
- Pull_Down_IN
- 21A MAX each Profet
- (in symbol Title_Block) Page Contents:; NR DEVELOPMENTS; Size:; Revision:; Variant:; Date:; Sheet; of

### Library data of the parts
C29 C33 = CAP: Manufacturer: KEMET; PartNumber: C0603C473M5RACTU
C30 C34 = CAP: as C2 on sheet PWR
C31 C35 = CAP: Manufacturer: KEMET; PartNumber: C0603C103M5RACTM
C32 C36 = CAP: Manufacturer: KEMET; PartNumber: C0603C221J5RACTU
D6 = Diode_Schottky: Manufacturer: NEXPERIA; PartNumber: BZX84W-C4V7-QX; Case: SOT-323-3
D7 = Diode_Schottky: as D4 on sheet MCU; Case: SOT-323-3
R18 R19 = Resistor: as R3 on sheet PWR
R20 R26 = Resistor: Manufacturer: Vishay; PartNumber: CRCW080547R0FKEA
R21-R24 R27-R30 = Resistor: Manufacturer: YAGEO; PartNumber: RC0603FR-074K7L
R25 R31 = Resistor: Manufacturer: Vishay; PartNumber: CRCW06031K20FKEA
U5 U6 = BTS7002-1EPP: Smart High-Side Power Switch 21A; Manufacturer: Infineon Technologies; PartNumber: BTS70021EPPXUMA1; Case: TSDSO-14

## Sheet HIGH_CURR_MOS2.SchDoc
size A4; SheetNumber: 6; SheetTotal: 14
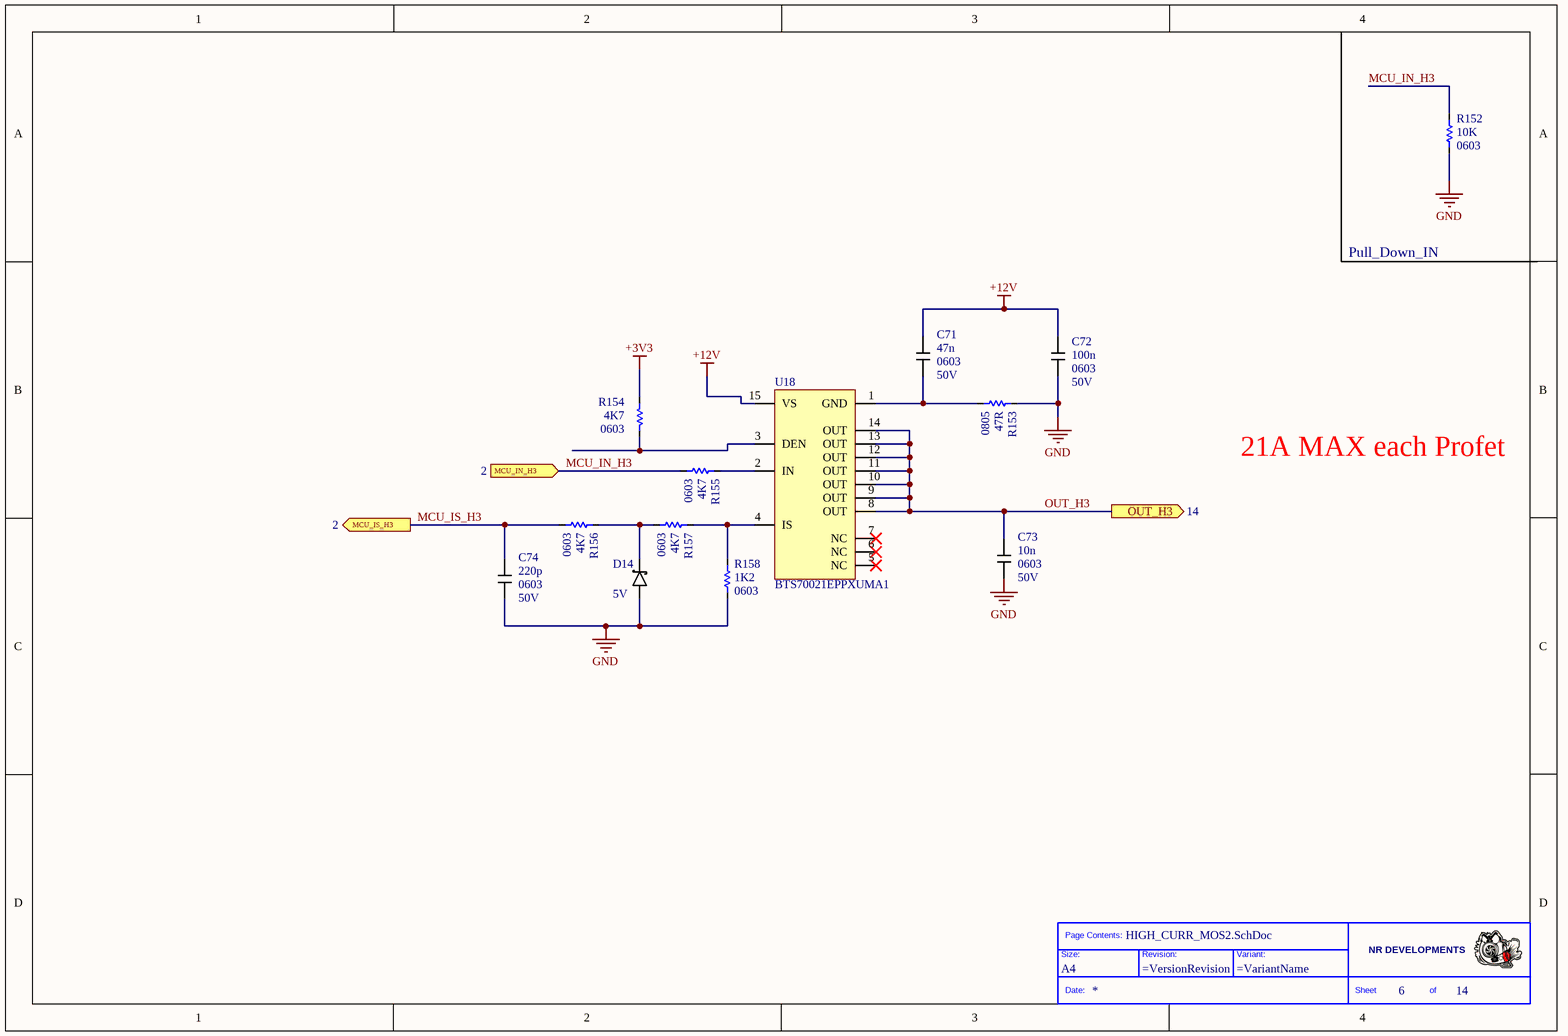
[diagram p5: HIGH_CURR_MOS2.SchDoc]

### Parts
(Parts that share a designator on the sheet are numbered #1, #2 ... from top to bottom, then left to right.)
*#6  Size: A4  (hidden comment: Title_Block)  (graphical)
C71  value 47n  Case: 0603  Voltage: 50V  [CAPC1608X09M]  (hidden comment: CAP)
C72  value 100n  Case: 0603  Voltage: 50V  [CAPC1608X09M]  (hidden comment: CAP)
C73  value 10n  Case: 0603  Voltage: 50V  [CAPC1608X09M]  (hidden comment: CAP)
C74  value 220p  Case: 0603  Voltage: 50V  [CAPC1608X09M]  (hidden comment: CAP)
D14  value 5V  [SOT65P210X100-3N - AC]  (hidden comment: Diode_Schottky)
R152  value 10K  Case: 0603  [RESC1608X06M]  (hidden comment: Res)
R153  value 47R  Case: 0805  [RESC2012X06N]  (hidden comment: Res)
R154  value 4K7  Case: 0603  [RESC1608X06M]  (hidden comment: Res)
R155  value 4K7  Case: 0603  [RESC1608X06M]  (hidden comment: Res)
R156  value 4K7  Case: 0603  [RESC1608X06M]  (hidden comment: Res)
R157  value 4K7  Case: 0603  [RESC1608X06M]  (hidden comment: Res)
R158  value 1K2  Case: 0603  [RESC1608X06M]  (hidden comment: Res)
U18  value BTS70021EPPXUMA1  [SOP65P600X115-15]  (hidden comment: BTS7002-1EPP)

### Ports
MCU_IN_H3 (in, see 2), MCU_IS_H3 (out, see 2), OUT_H3 (out, see 14)

### Nets
+3V3: R154.2
+12V: C71.1 C72.1 U18.15(VS)
GND: C72.2 C73.2 C74.2 D14.A R152.1 R153.2 R158.1
MCU_IN_H3: R152.2 R155.1 ; port MCU_IN_H3
MCU_IS_H3: C74.1 R156.1 ; port MCU_IS_H3
OUT_H3: C73.1 U18.8(OUT) U18.9(OUT) U18.10(OUT) U18.11(OUT) U18.12(OUT) U18.13(OUT) U18.14(OUT) ; port OUT_H3
NetC71_2: C71.2 R153.1 U18.1(GND)
NetD14_C: D14.C R156.2 R157.1
NetR154_1: R154.1 U18.3(DEN)
NetR155_2: R155.2 U18.2(IN)
NetR157_2: R157.2 R158.2 U18.4(IS)

Not connected (* = marked no-connect by the designer): U18 5(NC)* 6(NC)* 7(NC)*

### Notes on the sheet
- Pull_Down_IN
- 21A MAX each Profet
- (in symbol Title_Block) Page Contents:; NR DEVELOPMENTS; Size:; Revision:; Variant:; Date:; Sheet; of

### Library data of the parts
C71 = CAP: as C29 on sheet HIGH_CURR_MOS
C72 = CAP: as C2 on sheet PWR
C73 = CAP: as C31 on sheet HIGH_CURR_MOS
C74 = CAP: as C32 on sheet HIGH_CURR_MOS
D14 = Diode_Schottky: as D4 on sheet MCU; Case: SOT-323-3
R152 = Resistor: as R3 on sheet PWR
R153 = Resistor: as R20 on sheet HIGH_CURR_MOS
R154-R157 = Resistor: as R21 on sheet HIGH_CURR_MOS
R158 = Resistor: as R25 on sheet HIGH_CURR_MOS
U18 = BTS7002-1EPP: as U5 on sheet HIGH_CURR_MOS; PartNumber: BTS70021EPPXUMA1; Case: TSDSO-14

## Sheet MID_CURR_MOS.SchDoc
size A4; SheetNumber: 7; SheetTotal: 14
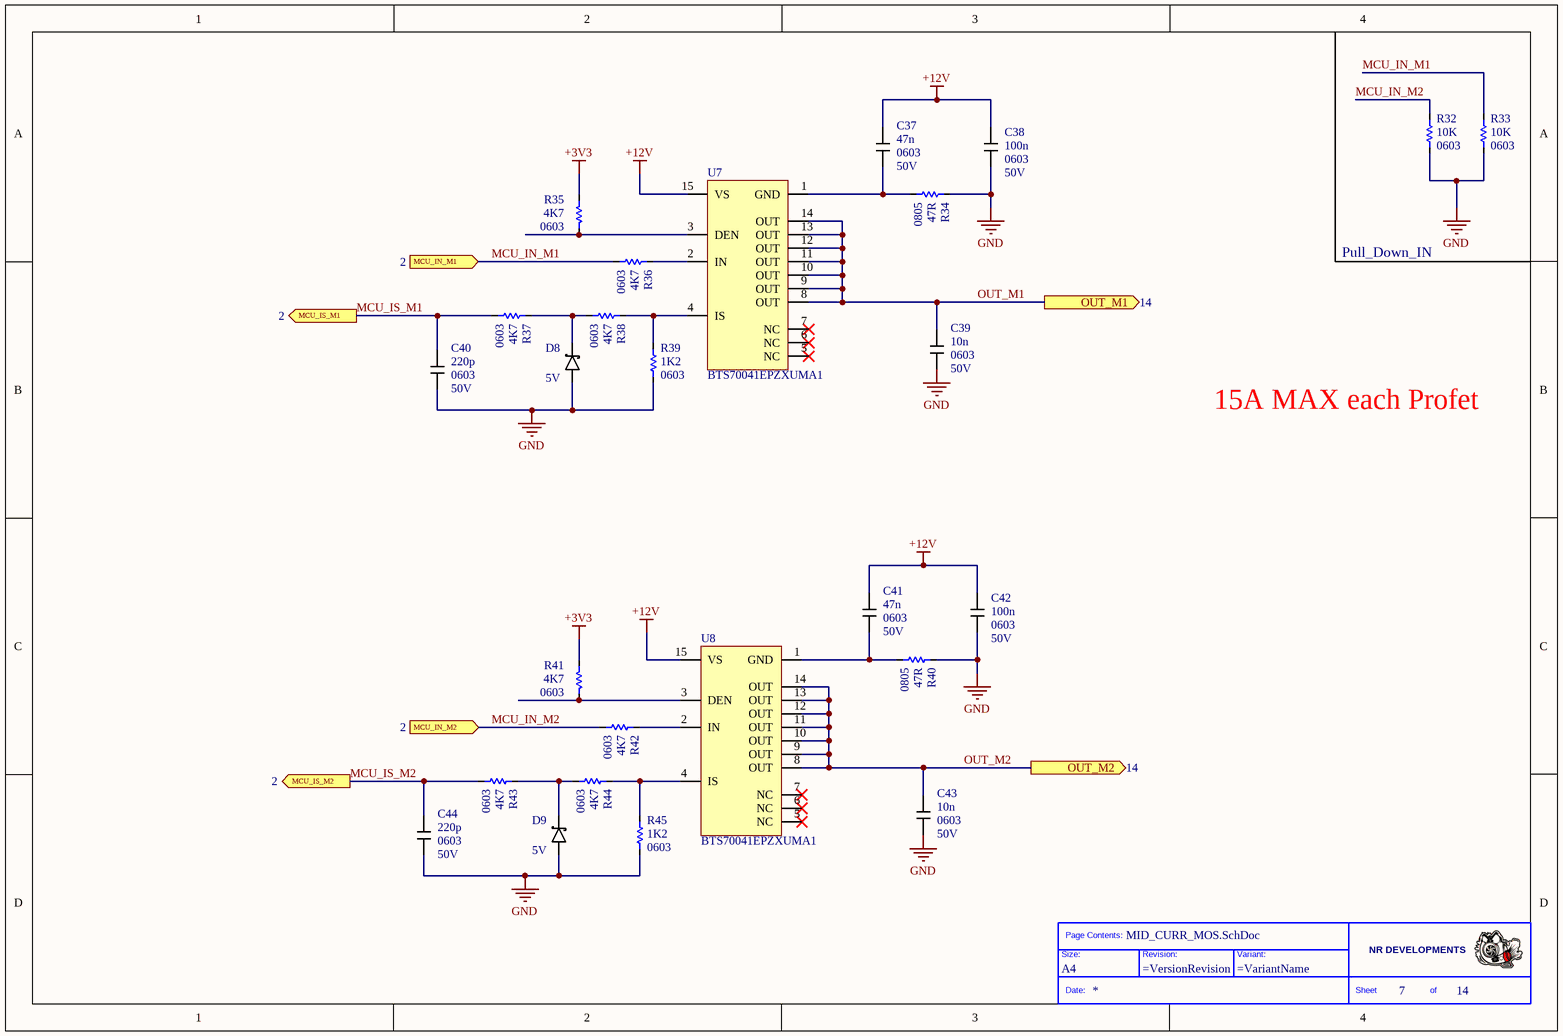
[diagram p6: MID_CURR_MOS.SchDoc]

### Parts
(Parts that share a designator on the sheet are numbered #1, #2 ... from top to bottom, then left to right.)
*?#1  Size: A4  (hidden comment: Title_Block)  (graphical)
C37  value 47n  Case: 0603  Voltage: 50V  [CAPC1608X09M]  (hidden comment: CAP)
C38  value 100n  Case: 0603  Voltage: 50V  [CAPC1608X09M]  (hidden comment: CAP)
C39  value 10n  Case: 0603  Voltage: 50V  [CAPC1608X09M]  (hidden comment: CAP)
C40  value 220p  Case: 0603  Voltage: 50V  [CAPC1608X09M]  (hidden comment: CAP)
C41  value 47n  Case: 0603  Voltage: 50V  [CAPC1608X09M]  (hidden comment: CAP)
C42  value 100n  Case: 0603  Voltage: 50V  [CAPC1608X09M]  (hidden comment: CAP)
C43  value 10n  Case: 0603  Voltage: 50V  [CAPC1608X09M]  (hidden comment: CAP)
C44  value 220p  Case: 0603  Voltage: 50V  [CAPC1608X09M]  (hidden comment: CAP)
D8  value 5V  [SOT65P210X100-3N - AC]  (hidden comment: Diode_Schottky)
D9  value 5V  [SOT65P210X100-3N - AC]  (hidden comment: Diode_Schottky)
R32  value 10K  Case: 0603  [RESC1608X06M]  (hidden comment: Res)
R33  value 10K  Case: 0603  [RESC1608X06M]  (hidden comment: Res)
R34  value 47R  Case: 0805  [RESC2012X06N]  (hidden comment: Res)
R35  value 4K7  Case: 0603  [RESC1608X06M]  (hidden comment: Res)
R36  value 4K7  Case: 0603  [RESC1608X06M]  (hidden comment: Res)
R37  value 4K7  Case: 0603  [RESC1608X06M]  (hidden comment: Res)
R38  value 4K7  Case: 0603  [RESC1608X06M]  (hidden comment: Res)
R39  value 1K2  Case: 0603  [RESC1608X06M]  (hidden comment: Res)
R40  value 47R  Case: 0805  [RESC2012X06N]  (hidden comment: Res)
R41  value 4K7  Case: 0603  [RESC1608X06M]  (hidden comment: Res)
R42  value 4K7  Case: 0603  [RESC1608X06M]  (hidden comment: Res)
R43  value 4K7  Case: 0603  [RESC1608X06M]  (hidden comment: Res)
R44  value 4K7  Case: 0603  [RESC1608X06M]  (hidden comment: Res)
R45  value 1K2  Case: 0603  [RESC1608X06M]  (hidden comment: Res)
U7  BTS70041EPZXUMA1  [SOP65P600X115-15]
U8  BTS70041EPZXUMA1  [SOP65P600X115-15]

### Ports
MCU_IN_M1 (in, see 2), MCU_IN_M2 (in, see 2), MCU_IS_M1 (out, see 2), MCU_IS_M2 (out, see 2), OUT_M1 (out, see 14), OUT_M2 (out, see 14)

### Nets
+3V3: R35.2 R41.2
+12V: C37.1 C38.1 C41.1 C42.1 U7.15(VS) U8.15(VS)
GND: C38.2 C39.2 C40.2 C42.2 C43.2 C44.2 D8.A D9.A R32.1 R33.1 R34.2 R39.1 R40.2 R45.1
MCU_IN_M1: R33.2 R36.1 ; port MCU_IN_M1
MCU_IN_M2: R32.2 R42.1 ; port MCU_IN_M2
MCU_IS_M1: C40.1 R37.1 ; port MCU_IS_M1
MCU_IS_M2: C44.1 R43.1 ; port MCU_IS_M2
OUT_M1: C39.1 U7.8(OUT) U7.9(OUT) U7.10(OUT) U7.11(OUT) U7.12(OUT) U7.13(OUT) U7.14(OUT) ; port OUT_M1
OUT_M2: C43.1 U8.8(OUT) U8.9(OUT) U8.10(OUT) U8.11(OUT) U8.12(OUT) U8.13(OUT) U8.14(OUT) ; port OUT_M2
NetC37_2: C37.2 R34.1 U7.1(GND)
NetC41_2: C41.2 R40.1 U8.1(GND)
NetD8_C: D8.C R37.2 R38.1
NetD9_C: D9.C R43.2 R44.1
NetR35_1: R35.1 U7.3(DEN)
NetR36_2: R36.2 U7.2(IN)
NetR38_2: R38.2 R39.2 U7.4(IS)
NetR41_1: R41.1 U8.3(DEN)
NetR42_2: R42.2 U8.2(IN)
NetR44_2: R44.2 R45.2 U8.4(IS)

Not connected (* = marked no-connect by the designer): U7 5(NC)* 6(NC)* 7(NC)*; U8 5(NC)* 6(NC)* 7(NC)*

### Notes on the sheet
- Pull_Down_IN
- 15A MAX each Profet
- (in symbol Title_Block) Page Contents:; NR DEVELOPMENTS; Size:; Revision:; Variant:; Date:; Sheet; of

### Library data of the parts
C37 C41 = CAP: as C29 on sheet HIGH_CURR_MOS
C38 C42 = CAP: as C2 on sheet PWR
C39 C43 = CAP: as C31 on sheet HIGH_CURR_MOS
C40 C44 = CAP: as C32 on sheet HIGH_CURR_MOS
D8 D9 = Diode_Schottky: as D4 on sheet MCU; Case: SOT-323-3
R32 R33 = Resistor: as R3 on sheet PWR
R34 R40 = Resistor: as R20 on sheet HIGH_CURR_MOS
R35-R38 R41-R44 = Resistor: as R21 on sheet HIGH_CURR_MOS
R39 R45 = Resistor: as R25 on sheet HIGH_CURR_MOS
U7 U8 = BTS70041EPZXUMA1: Smart High-Side Power Switch 15A; Manufacturer: Infineon Technologies; PartNumber: BTS70041EPZXUMA1; Case: TSDSO-14; Value: BTS70041EPZXUMA1

## Sheet LOW_CURR_MOS.SchDoc
size A4; SheetNumber: 8; SheetTotal: 14
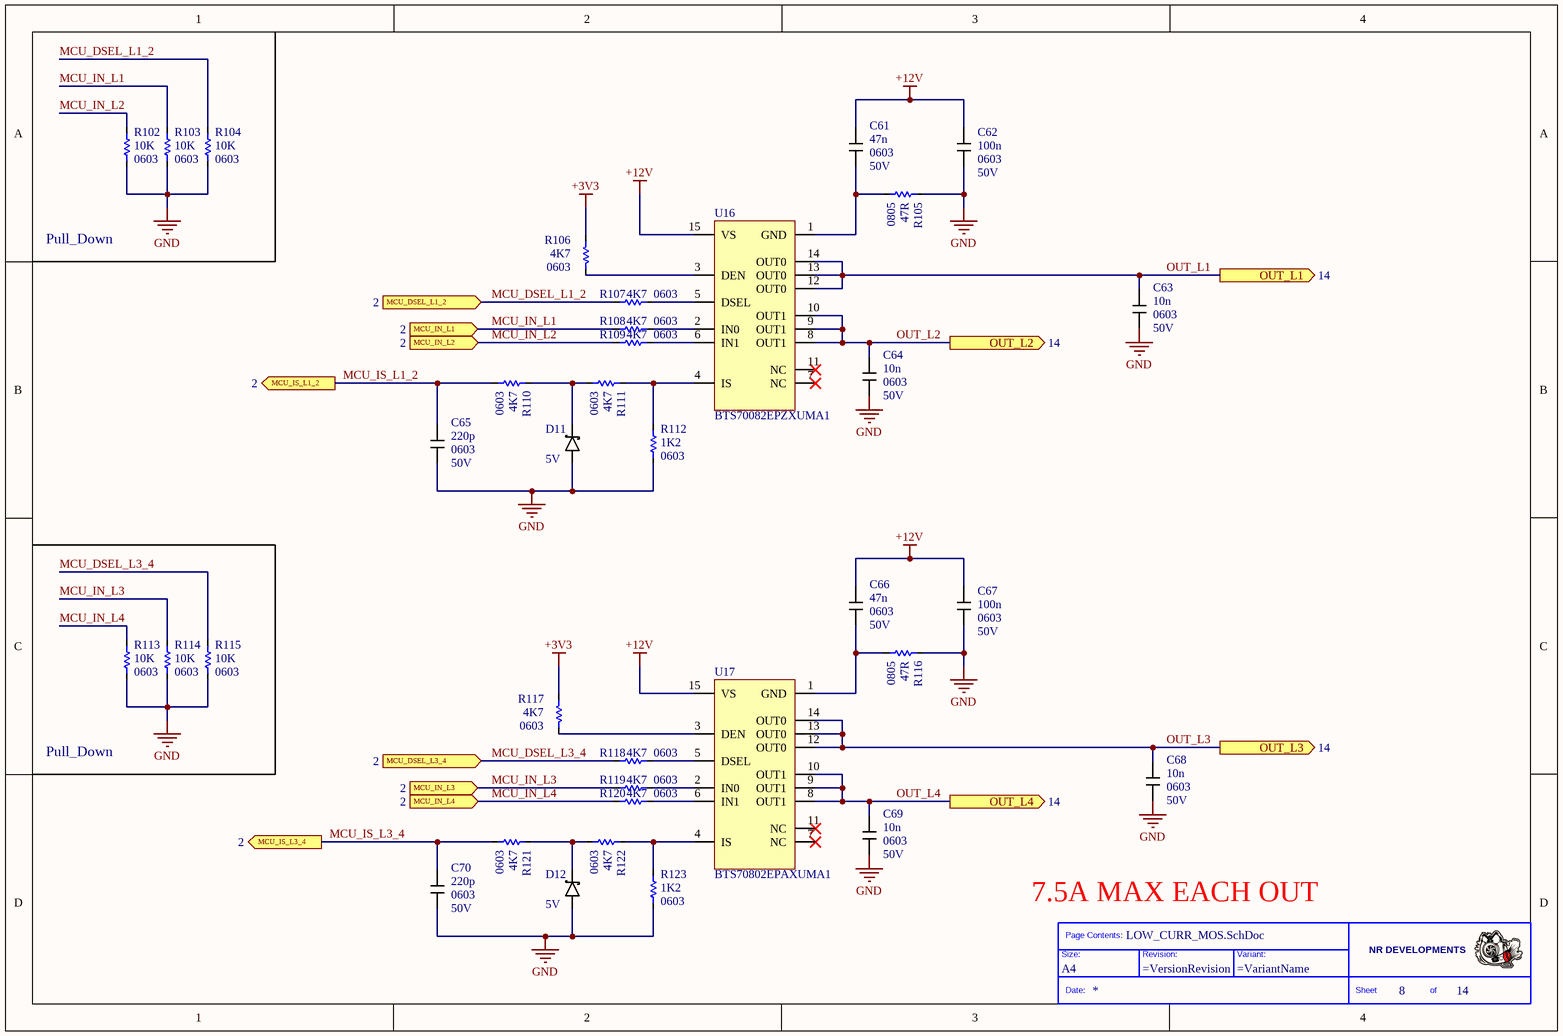
[diagram p7: LOW_CURR_MOS.SchDoc]

### Parts
(Parts that share a designator on the sheet are numbered #1, #2 ... from top to bottom, then left to right.)
*#7  Size: A4  (hidden comment: Title_Block)  (graphical)
C61  value 47n  Case: 0603  Voltage: 50V  [CAPC1608X09M]  (hidden comment: CAP)
C62  value 100n  Case: 0603  Voltage: 50V  [CAPC1608X09M]  (hidden comment: CAP)
C63  value 10n  Case: 0603  Voltage: 50V  [CAPC1608X09M]  (hidden comment: CAP)
C64  value 10n  Case: 0603  Voltage: 50V  [CAPC1608X09M]  (hidden comment: CAP)
C65  value 220p  Case: 0603  Voltage: 50V  [CAPC1608X09M]  (hidden comment: CAP)
C66  value 47n  Case: 0603  Voltage: 50V  [CAPC1608X09M]  (hidden comment: CAP)
C67  value 100n  Case: 0603  Voltage: 50V  [CAPC1608X09M]  (hidden comment: CAP)
C68  value 10n  Case: 0603  Voltage: 50V  [CAPC1608X09M]  (hidden comment: CAP)
C69  value 10n  Case: 0603  Voltage: 50V  [CAPC1608X09M]  (hidden comment: CAP)
C70  value 220p  Case: 0603  Voltage: 50V  [CAPC1608X09M]  (hidden comment: CAP)
D11  value 5V  [SOT65P210X100-3N - AC]  (hidden comment: Diode_Schottky)
D12  value 5V  [SOT65P210X100-3N - AC]  (hidden comment: Diode_Schottky)
R102  value 10K  Case: 0603  [RESC1608X06M]  (hidden comment: Res)
R103  value 10K  Case: 0603  [RESC1608X06M]  (hidden comment: Res)
R104  value 10K  Case: 0603  [RESC1608X06M]  (hidden comment: Res)
R105  value 47R  Case: 0805  [RESC2012X06N]  (hidden comment: Res)
R106  value 4K7  Case: 0603  [RESC1608X06M]  (hidden comment: Res)
R107  value 4K7  Case: 0603  [RESC1608X06M]  (hidden comment: Res)
R108  value 4K7  Case: 0603  [RESC1608X06M]  (hidden comment: Res)
R109  value 4K7  Case: 0603  [RESC1608X06M]  (hidden comment: Res)
R110  value 4K7  Case: 0603  [RESC1608X06M]  (hidden comment: Res)
R111  value 4K7  Case: 0603  [RESC1608X06M]  (hidden comment: Res)
R112  value 1K2  Case: 0603  [RESC1608X06M]  (hidden comment: Res)
R113  value 10K  Case: 0603  [RESC1608X06M]  (hidden comment: Res)
R114  value 10K  Case: 0603  [RESC1608X06M]  (hidden comment: Res)
R115  value 10K  Case: 0603  [RESC1608X06M]  (hidden comment: Res)
R116  value 47R  Case: 0805  [RESC2012X06N]  (hidden comment: Res)
R117  value 4K7  Case: 0603  [RESC1608X06M]  (hidden comment: Res)
R118  value 4K7  Case: 0603  [RESC1608X06M]  (hidden comment: Res)
R119  value 4K7  Case: 0603  [RESC1608X06M]  (hidden comment: Res)
R120  value 4K7  Case: 0603  [RESC1608X06M]  (hidden comment: Res)
R121  value 4K7  Case: 0603  [RESC1608X06M]  (hidden comment: Res)
R122  value 4K7  Case: 0603  [RESC1608X06M]  (hidden comment: Res)
R123  value 1K2  Case: 0603  [RESC1608X06M]  (hidden comment: Res)
U16  BTS70082EPZXUMA1  [SOP65P600X115-15]
U17  BTS70802EPAXUMA1  [SOP65P600X115-15]

### Ports
MCU_DSEL_L1_2 (in, see 2), MCU_DSEL_L3_4 (in, see 2), MCU_IN_L1 (in, see 2), MCU_IN_L2 (in, see 2), MCU_IN_L3 (in, see 2), MCU_IN_L4 (in, see 2), MCU_IS_L1_2 (out, see 2), MCU_IS_L3_4 (out, see 2), OUT_L1 (out, see 14), OUT_L2 (out, see 14), OUT_L3 (out, see 14), OUT_L4 (out, see 14)

### Nets
+3V3: R106.2 R117.2
+12V: C61.1 C62.1 C66.1 C67.1 U16.15(VS) U17.15(VS)
GND: C62.2 C63.2 C64.2 C65.2 C67.2 C68.2 C69.2 C70.2 D11.A D12.A R102.1 R103.1 R104.1 R105.2 R112.1 R113.1 R114.1 R115.1 R116.2 R123.1
MCU_DSEL_L1_2: R104.2 R107.1 ; port MCU_DSEL_L1_2
MCU_DSEL_L3_4: R115.2 R118.1 ; port MCU_DSEL_L3_4
MCU_IN_L1: R103.2 R108.1 ; port MCU_IN_L1
MCU_IN_L2: R102.2 R109.1 ; port MCU_IN_L2
MCU_IN_L3: R114.2 R119.1 ; port MCU_IN_L3
MCU_IN_L4: R113.2 R120.1 ; port MCU_IN_L4
MCU_IS_L1_2: C65.1 R110.1 ; port MCU_IS_L1_2
MCU_IS_L3_4: C70.1 R121.1 ; port MCU_IS_L3_4
OUT_L1: C63.1 U16.12(OUT0) U16.13(OUT0) U16.14(OUT0) ; port OUT_L1
OUT_L2: C64.1 U16.8(OUT1) U16.9(OUT1) U16.10(OUT1) ; port OUT_L2
OUT_L3: C68.1 U17.12(OUT0) U17.13(OUT0) U17.14(OUT0) ; port OUT_L3
OUT_L4: C69.1 U17.8(OUT1) U17.9(OUT1) U17.10(OUT1) ; port OUT_L4
NetC61_2: C61.2 R105.1 U16.1(GND)
NetC66_2: C66.2 R116.1 U17.1(GND)
NetD11_C: D11.C R110.2 R111.1
NetD12_C: D12.C R121.2 R122.1
NetR106_1: R106.1 U16.3(DEN)
NetR107_2: R107.2 U16.5(DSEL)
NetR108_2: R108.2 U16.2(IN0)
NetR109_2: R109.2 U16.6(IN1)
NetR111_2: R111.2 R112.2 U16.4(IS)
NetR117_1: R117.1 U17.3(DEN)
NetR118_2: R118.2 U17.5(DSEL)
NetR119_2: R119.2 U17.2(IN0)
NetR120_2: R120.2 U17.6(IN1)
NetR122_2: R122.2 R123.2 U17.4(IS)

Not connected (* = marked no-connect by the designer): U16 7(NC)* 11(NC)*; U17 7(NC)* 11(NC)*

### Notes on the sheet
- Pull_Down
- 7.5A MAX EACH OUT
- (in symbol Title_Block) Page Contents:; NR DEVELOPMENTS; Size:; Revision:; Variant:; Date:; Sheet; of

### Library data of the parts
C61 C66 = CAP: as C29 on sheet HIGH_CURR_MOS
C62 C67 = CAP: as C2 on sheet PWR
C63 C64 C68 C69 = CAP: as C31 on sheet HIGH_CURR_MOS
C65 C70 = CAP: as C32 on sheet HIGH_CURR_MOS
D11 D12 = Diode_Schottky: as D4 on sheet MCU; Case: SOT-323-3
R102-R104 R113-R115 = Resistor: as R3 on sheet PWR
R105 R116 = Resistor: as R20 on sheet HIGH_CURR_MOS
R106-R111 R117-R122 = Resistor: as R21 on sheet HIGH_CURR_MOS
R112 R123 = Resistor: as R25 on sheet HIGH_CURR_MOS
U16 = BTS70082EPZXUMA1: Smart High-Side Power Switch 7.5A; Manufacturer: Infineon Technologies; PartNumber: BTS70082EPZXUMA1; Case: TSDSO-14; Value: BTS70082EPZXUMA1
U17 = BTS70802EPAXUMA1: Smart High-Side Power Switch 3A; Manufacturer: Infineon Technologies; PartNumber: BTS70802EPAXUMA1; Case: TSDSO-14; Value: BTS70802EPAXUMA1

## Sheet SENSOR_INP.SchDoc
size A4; SheetNumber: 9; SheetTotal: 14
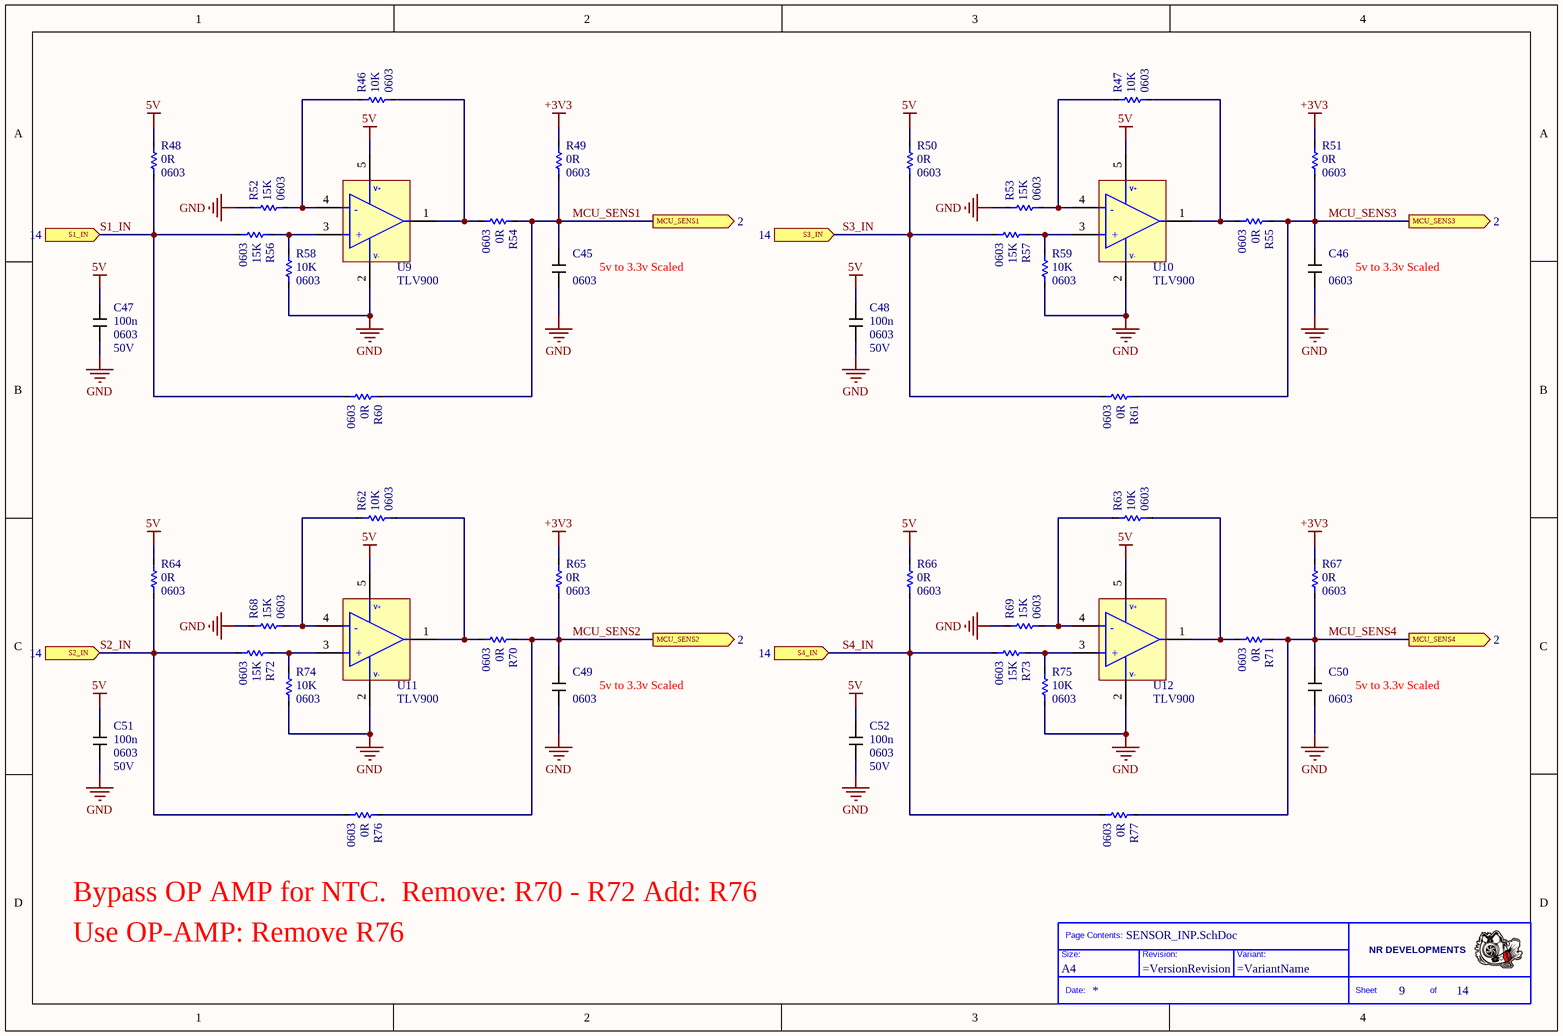
[diagram p8: SENSOR_INP.SchDoc]

### Parts
(Parts that share a designator on the sheet are numbered #1, #2 ... from top to bottom, then left to right.)
*?#2  Size: A4  (hidden comment: Title_Block)  (graphical)
C45  Case: 0603  [CAPC1608X09M]  (hidden comment: CAP)
C46  Case: 0603  [CAPC1608X09M]  (hidden comment: CAP)
C47  value 100n  Case: 0603  Voltage: 50V  [CAPC1608X09M]  (hidden comment: CAP)
C48  value 100n  Case: 0603  Voltage: 50V  [CAPC1608X09M]  (hidden comment: CAP)
C49  Case: 0603  [CAPC1608X09M]  (hidden comment: CAP)
C50  Case: 0603  [CAPC1608X09M]  (hidden comment: CAP)
C51  value 100n  Case: 0603  Voltage: 50V  [CAPC1608X09M]  (hidden comment: CAP)
C52  value 100n  Case: 0603  Voltage: 50V  [CAPC1608X09M]  (hidden comment: CAP)
R46  value 10K  Case: 0603  [RESC1608X06M]  (hidden comment: Res)
R47  value 10K  Case: 0603  [RESC1608X06M]  (hidden comment: Res)
R48  value 0R  Case: 0603  [RESC1608X06M]  (hidden comment: Res)
R49  value 0R  Case: 0603  [RESC1608X06M]  (hidden comment: Res)
R50  value 0R  Case: 0603  [RESC1608X06M]  (hidden comment: Res)
R51  value 0R  Case: 0603  [RESC1608X06M]  (hidden comment: Res)
R52  value 15K  Case: 0603  [RESC1608X06M]  (hidden comment: Res)
R53  value 15K  Case: 0603  [RESC1608X06M]  (hidden comment: Res)
R54  value 0R  Case: 0603  [RESC1608X06M]  (hidden comment: Res)
R55  value 0R  Case: 0603  [RESC1608X06M]  (hidden comment: Res)
R56  value 15K  Case: 0603  [RESC1608X06M]  (hidden comment: Res)
R57  value 15K  Case: 0603  [RESC1608X06M]  (hidden comment: Res)
R58  value 10K  Case: 0603  [RESC1608X06M]  (hidden comment: Res)
R59  value 10K  Case: 0603  [RESC1608X06M]  (hidden comment: Res)
R60  value 0R  Case: 0603  [RESC1608X06M]  (hidden comment: Res)
R61  value 0R  Case: 0603  [RESC1608X06M]  (hidden comment: Res)
R62  value 10K  Case: 0603  [RESC1608X06M]  (hidden comment: Res)
R63  value 10K  Case: 0603  [RESC1608X06M]  (hidden comment: Res)
R64  value 0R  Case: 0603  [RESC1608X06M]  (hidden comment: Res)
R65  value 0R  Case: 0603  [RESC1608X06M]  (hidden comment: Res)
R66  value 0R  Case: 0603  [RESC1608X06M]  (hidden comment: Res)
R67  value 0R  Case: 0603  [RESC1608X06M]  (hidden comment: Res)
R68  value 15K  Case: 0603  [RESC1608X06M]  (hidden comment: Res)
R69  value 15K  Case: 0603  [RESC1608X06M]  (hidden comment: Res)
R70  value 0R  Case: 0603  [RESC1608X06M]  (hidden comment: Res)
R71  value 0R  Case: 0603  [RESC1608X06M]  (hidden comment: Res)
R72  value 15K  Case: 0603  [RESC1608X06M]  (hidden comment: Res)
R73  value 15K  Case: 0603  [RESC1608X06M]  (hidden comment: Res)
R74  value 10K  Case: 0603  [RESC1608X06M]  (hidden comment: Res)
R75  value 10K  Case: 0603  [RESC1608X06M]  (hidden comment: Res)
R76  value 0R  Case: 0603  [RESC1608X06M]  (hidden comment: Res)
R77  value 0R  Case: 0603  [RESC1608X06M]  (hidden comment: Res)
U9  TLV900  [SOT95P280X145-5N]
U10  TLV900  [SOT95P280X145-5N]
U11  TLV900  [SOT95P280X145-5N]
U12  TLV900  [SOT95P280X145-5N]

### Ports
MCU_SENS1 (out, see 2), MCU_SENS2 (out, see 2), MCU_SENS3 (out, see 2), MCU_SENS4 (out, see 2), S1_IN (in, see 14), S2_IN (in, see 14), S3_IN (in, see 14), S4_IN (in, see 14)

### Nets
5V: C47.1 C48.1 C51.1 C52.1 R48.2 R50.2 R64.2 R66.2 U9.5(V+) U10.5(V+) U11.5(V+) U12.5(V+)
+3V3: R49.2 R51.2 R65.2 R67.2
GND: C45.2 C46.2 C47.2 C48.2 C49.2 C50.2 C51.2 C52.2 R52.2 R53.2 R58.1 R59.1 R68.2 R69.2 R74.1 R75.1 U9.2(V-) U10.2(V-) U11.2(V-) U12.2(V-)
MCU_SENS1: C45.1 R49.1 R54.2 R60.2 ; port MCU_SENS1
MCU_SENS2: C49.1 R65.1 R70.2 R76.2 ; port MCU_SENS2
MCU_SENS3: C46.1 R51.1 R55.2 R61.2 ; port MCU_SENS3
MCU_SENS4: C50.1 R67.1 R71.2 R77.2 ; port MCU_SENS4
S1_IN: R48.1 R56.1 R60.1 ; port S1_IN
S2_IN: R64.1 R72.1 R76.1 ; port S2_IN
S3_IN: R50.1 R57.1 R61.1 ; port S3_IN
S4_IN: R66.1 R73.1 R77.1 ; port S4_IN
NetR46_1: R46.1 R54.1 U9.1(OUTA)
NetR46_2: R46.2 R52.1 U9.4(IN-)
NetR47_1: R47.1 R55.1 U10.1(OUTA)
NetR47_2: R47.2 R53.1 U10.4(IN-)
NetR56_2: R56.2 R58.2 U9.3(IN+)
NetR57_2: R57.2 R59.2 U10.3(IN+)
NetR62_1: R62.1 R70.1 U11.1(OUTA)
NetR62_2: R62.2 R68.1 U11.4(IN-)
NetR63_1: R63.1 R71.1 U12.1(OUTA)
NetR63_2: R63.2 R69.1 U12.4(IN-)
NetR72_2: R72.2 R74.2 U11.3(IN+)
NetR73_2: R73.2 R75.2 U12.3(IN+)

### Notes on the sheet
- (near C45) 5v to 3.3v Scaled
- (near C46) 5v to 3.3v Scaled
- (near C49) 5v to 3.3v Scaled
- (near C50) 5v to 3.3v Scaled
- Bypass OP AMP for NTC.  Remove: R70 - R72 Add: R76
- Use OP-AMP: Remove R76
- (in symbol Title_Block) Page Contents:; NR DEVELOPMENTS; Size:; Revision:; Variant:; Date:; Sheet; of
- (in symbol TLV900) -; +

### Library data of the parts
C47 C48 C51 C52 = CAP: as C2 on sheet PWR
R46 R47 R58 R59 R62 R63 R74 R75 = Resistor: as R3 on sheet PWR
R48-R51 R54 R55 R60 R61 R64-R67 R70 R71 R76 R77 = Resistor: as R7 on sheet PWR
R52 R53 R56 R57 R68 R69 R72 R73 = Resistor: Manufacturer: Vishay; PartNumber: CRCW060315K0FKEC
U9-U12 = TLV900: Amp. op. One-channel, 1-MHz rail-to-rail input and output 1.8-V to 5.5-V operational amplifier 5-SOT-23 -40 to 125; Manufacturer: Texas Instrument; PartNumber: TLV9001IDBVR; Value: TLV9001IDBVR; Case: SOT23-5

## Sheet DIGITAL_INP.SchDoc
size A4; SheetNumber: 10; SheetTotal: 14
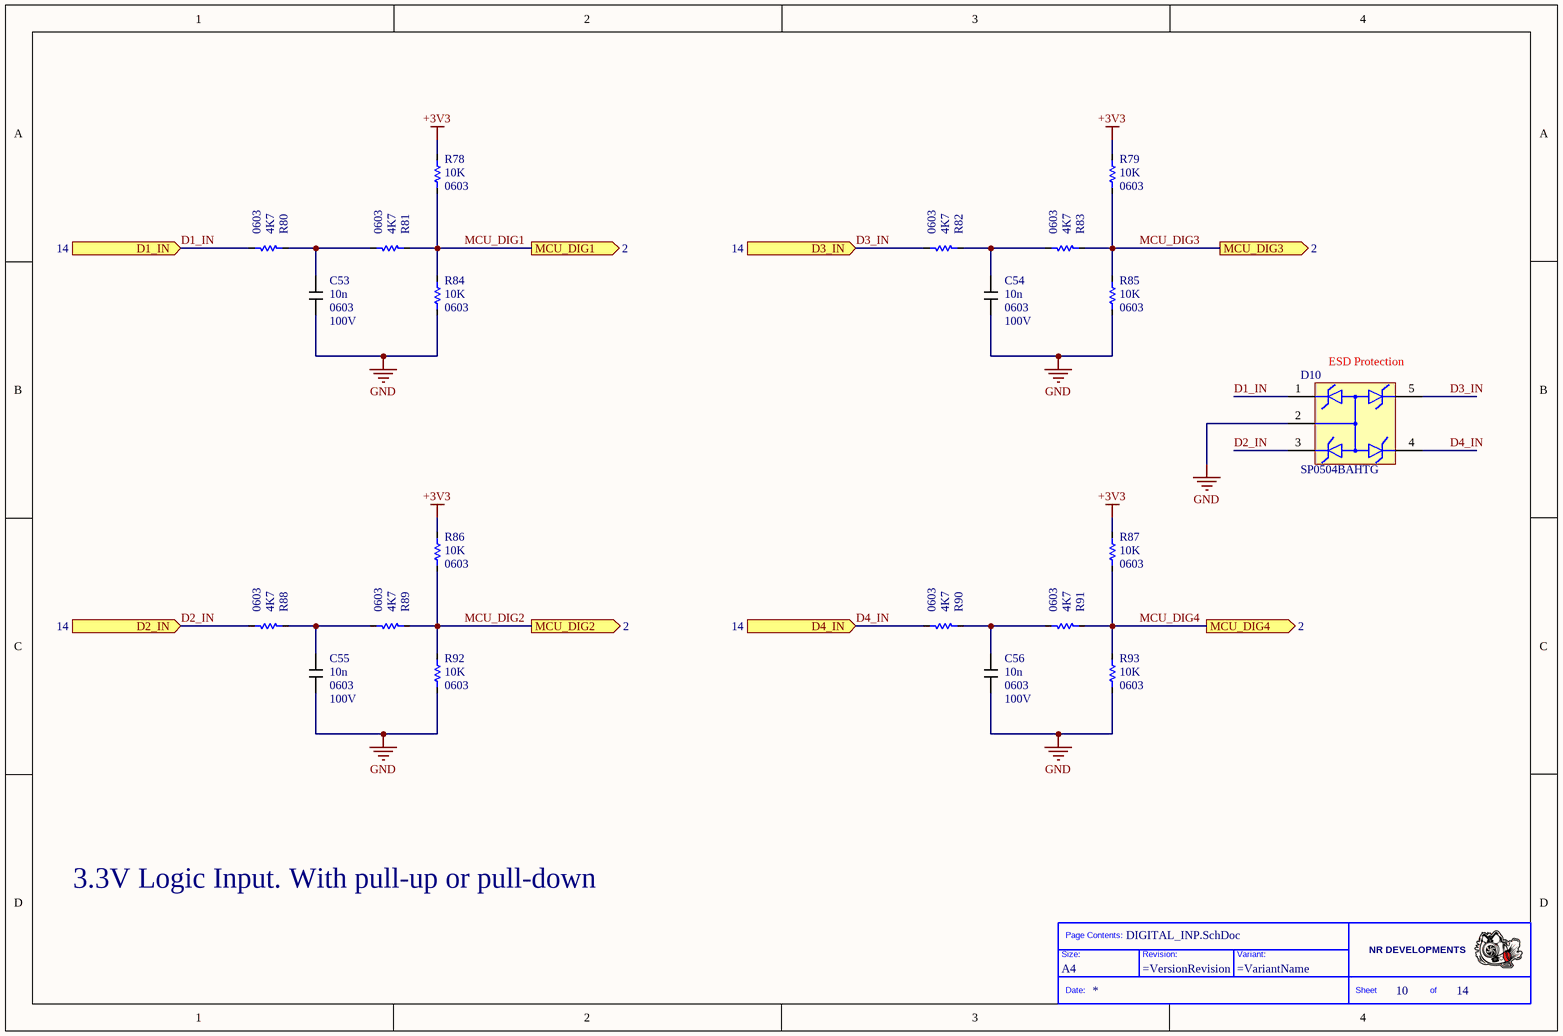
[diagram p9: DIGITAL_INP.SchDoc]

### Parts
(Parts that share a designator on the sheet are numbered #1, #2 ... from top to bottom, then left to right.)
*#8  Size: A4  (hidden comment: Title_Block)  (graphical)
C53  value 10n  Case: 0603  Voltage: 100V  [CAPC1608X09M]  (hidden comment: CAP)
C54  value 10n  Case: 0603  Voltage: 100V  [CAPC1608X09M]  (hidden comment: CAP)
C55  value 10n  Case: 0603  Voltage: 100V  [CAPC1608X09M]  (hidden comment: CAP)
C56  value 10n  Case: 0603  Voltage: 100V  [CAPC1608X09M]  (hidden comment: CAP)
D10  value SP0504BAHTG  [SOT95P280X145-5N]  (hidden comment: Diode TVS)
R78  value 10K  Case: 0603  [RESC1608X06M]  (hidden comment: Res)
R79  value 10K  Case: 0603  [RESC1608X06M]  (hidden comment: Res)
R80  value 4K7  Case: 0603  [RESC1608X06M]  (hidden comment: Res)
R81  value 4K7  Case: 0603  [RESC1608X06M]  (hidden comment: Res)
R82  value 4K7  Case: 0603  [RESC1608X06M]  (hidden comment: Res)
R83  value 4K7  Case: 0603  [RESC1608X06M]  (hidden comment: Res)
R84  value 10K  Case: 0603  [RESC1608X06M]  (hidden comment: Res)
R85  value 10K  Case: 0603  [RESC1608X06M]  (hidden comment: Res)
R86  value 10K  Case: 0603  [RESC1608X06M]  (hidden comment: Res)
R87  value 10K  Case: 0603  [RESC1608X06M]  (hidden comment: Res)
R88  value 4K7  Case: 0603  [RESC1608X06M]  (hidden comment: Res)
R89  value 4K7  Case: 0603  [RESC1608X06M]  (hidden comment: Res)
R90  value 4K7  Case: 0603  [RESC1608X06M]  (hidden comment: Res)
R91  value 4K7  Case: 0603  [RESC1608X06M]  (hidden comment: Res)
R92  value 10K  Case: 0603  [RESC1608X06M]  (hidden comment: Res)
R93  value 10K  Case: 0603  [RESC1608X06M]  (hidden comment: Res)

### Ports
D1_IN (in, see 14), D2_IN (in, see 14), D3_IN (in, see 14), D4_IN (in, see 14), MCU_DIG1 (out, see 2), MCU_DIG2 (out, see 2), MCU_DIG3 (out, see 2), MCU_DIG4 (out, see 2)

### Nets
+3V3: R78.2 R79.2 R86.2 R87.2
GND: C53.2 C54.2 C55.2 C56.2 D10.2 R84.1 R85.1 R92.1 R93.1
D1_IN: D10.1 R80.1 ; port D1_IN
D2_IN: D10.3 R88.1 ; port D2_IN
D3_IN: D10.5 R82.1 ; port D3_IN
D4_IN: D10.4 R90.1 ; port D4_IN
MCU_DIG1: R78.1 R81.2 R84.2 ; port MCU_DIG1
MCU_DIG2: R86.1 R89.2 R92.2 ; port MCU_DIG2
MCU_DIG3: R79.1 R83.2 R85.2 ; port MCU_DIG3
MCU_DIG4: R87.1 R91.2 R93.2 ; port MCU_DIG4
NetC53_1: C53.1 R80.2 R81.1
NetC54_1: C54.1 R82.2 R83.1
NetC55_1: C55.1 R88.2 R89.1
NetC56_1: C56.1 R90.2 R91.1

### Notes on the sheet
- (near D10) ESD Protection
- 3.3V Logic Input. With pull-up or pull-down
- (in symbol Title_Block) Page Contents:; NR DEVELOPMENTS; Size:; Revision:; Variant:; Date:; Sheet; of

### Library data of the parts
C53-C56 = CAP: Manufacturer: KEMET; PartNumber: C0603C103K1RACTU
D10 = SP0504BAHTG: Manufacturer: Littelfuse; Case: SOT-23-5; PartNumber: SP0504BAHTG
R78 R79 R84-R87 R92 R93 = Resistor: as R3 on sheet PWR
R80-R83 R88-R91 = Resistor: as R21 on sheet HIGH_CURR_MOS

## Sheet I2C.SchDoc
size A4; SheetNumber: 11; SheetTotal: 14
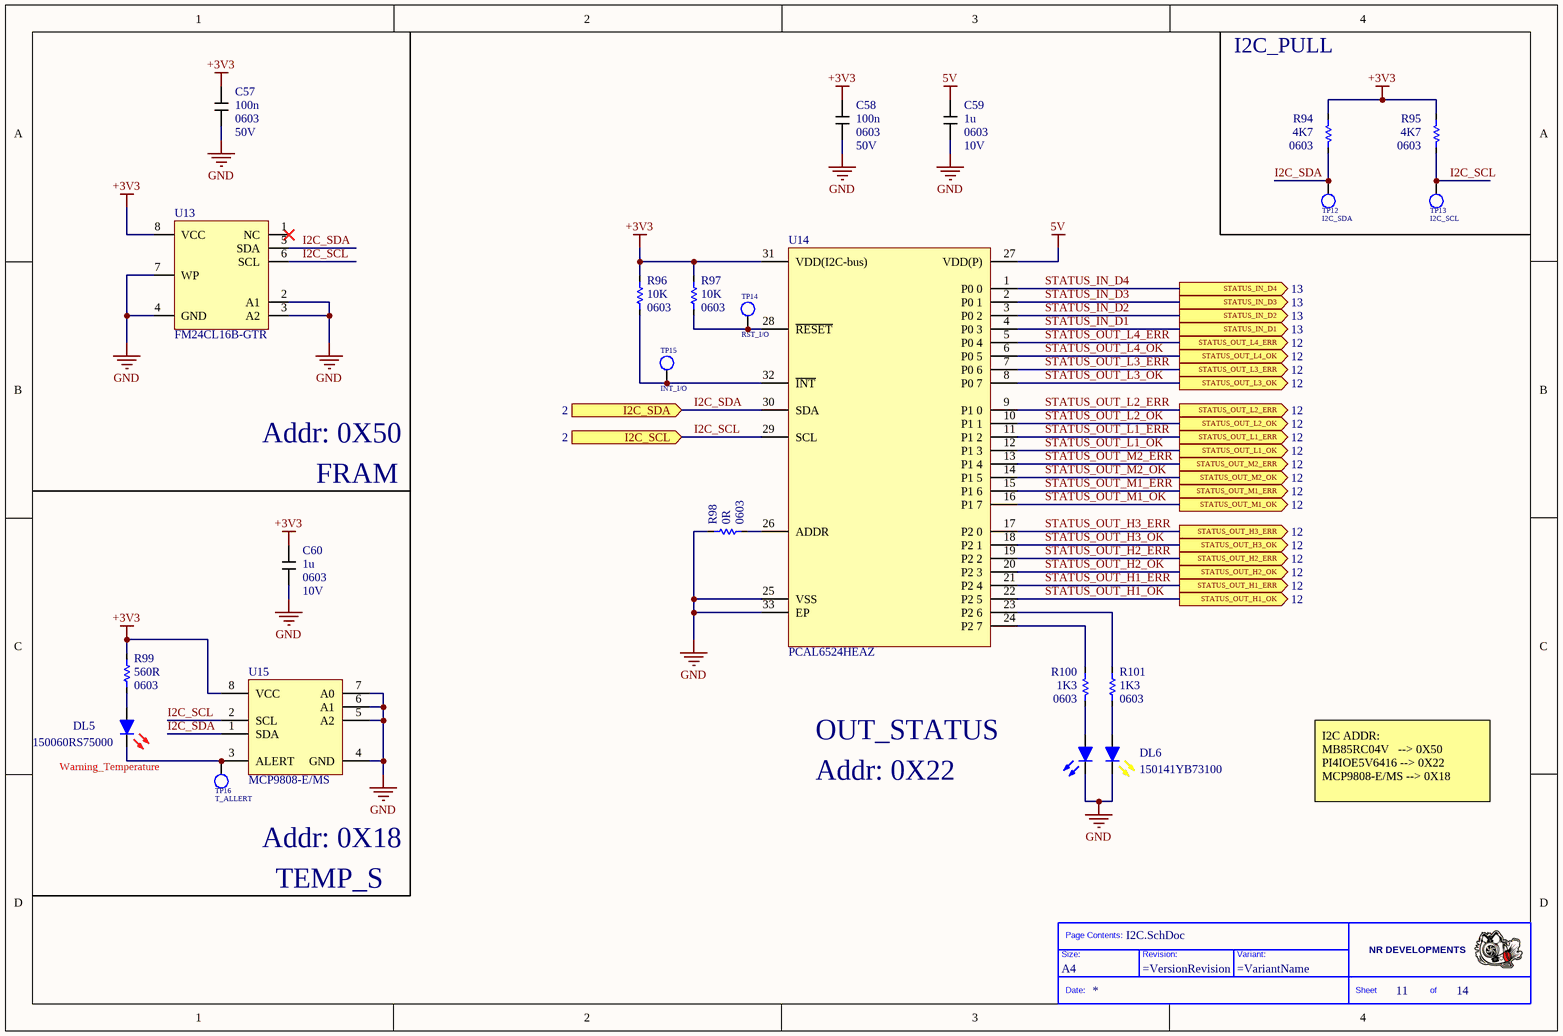
[diagram p10: I2C.SchDoc]

### Parts
(Parts that share a designator on the sheet are numbered #1, #2 ... from top to bottom, then left to right.)
*#9  Size: A4  (hidden comment: Title_Block)  (graphical)
C57  value 100n  Case: 0603  Voltage: 50V  [CAPC1608X09M]  (hidden comment: CAP)
C58  value 100n  Case: 0603  Voltage: 50V  [CAPC1608X09M]  (hidden comment: CAP)
C59  value 1u  Case: 0603  Voltage: 10V  [CAPC1608X09M]  (hidden comment: CAP)
C60  value 1u  Case: 0603  Voltage: 10V  [CAPC1608X09M]  (hidden comment: CAP)
DL5  value 150060RS75000  [LED0603]  (hidden comment: LED_Red)
DL6  value 150141YB73100  [WURTH-SBTW_3528]  (hidden comment: LED_Yellow_Blue)
R94  value 4K7  Case: 0603  [RESC1608X06M]  (hidden comment: Res)
R95  value 4K7  Case: 0603  [RESC1608X06M]  (hidden comment: Res)
R96  value 10K  Case: 0603  [RESC1608X06M]  (hidden comment: Res)
R97  value 10K  Case: 0603  [RESC1608X06M]  (hidden comment: Res)
R98  value 0R  Case: 0603  [RESC1608X06M]  (hidden comment: Res)
R99  value 560R  Case: 0603  [RESC1608X06M]  (hidden comment: Res)
R100  value 1K3  Case: 0603  [RESC1608X06M]  (hidden comment: Res)
R101  value 1K3  Case: 0603  [RESC1608X06M]  (hidden comment: Res)
TP12  I2C_SDA  [TP_c200]
TP13  I2C_SCL  [TP_c200]
TP14  RST_I/O  [TP_c200]
TP15  INT_I/O  [TP_c200]
TP16  T_ALLERT  [TP_c200]
U13  value FM24CL16B-GTR  [SOIC127P600X175-8N]  (hidden comment: MB85RC04V)
U14  PCAL6524HEAZ  [FP-SOT1426-1-IPC_A]
U15  MCP9808-E/MS  [MCHP-MSOP-MS8_N]

### Ports
I2C_SCL (in, see 2), I2C_SDA (in, see 2), STATUS_IN_D1 (out, see 13), STATUS_IN_D2 (out, see 13), STATUS_IN_D3 (out, see 13), STATUS_IN_D4 (out, see 13), STATUS_OUT_H1_ERR (out, see 12), STATUS_OUT_H1_OK (out, see 12), STATUS_OUT_H2_ERR (out, see 12), STATUS_OUT_H2_OK (out, see 12), STATUS_OUT_H3_ERR (out, see 12), STATUS_OUT_H3_OK (out, see 12), STATUS_OUT_L1_ERR (out, see 12), STATUS_OUT_L1_OK (out, see 12), STATUS_OUT_L2_ERR (out, see 12), STATUS_OUT_L2_OK (out, see 12), STATUS_OUT_L3_ERR (out, see 12), STATUS_OUT_L3_OK (out, see 12), STATUS_OUT_L4_ERR (out, see 12), STATUS_OUT_L4_OK (out, see 12), STATUS_OUT_M1_ERR (out, see 12), STATUS_OUT_M1_OK (out, see 12), STATUS_OUT_M2_ERR (out, see 12), STATUS_OUT_M2_OK (out, see 12)

### Nets
5V: C59.1 U14.27(VDD(P))
+3V3: C57.1 C58.1 C60.1 R94.2 R95.2 R96.2 R97.2 R99.2 U13.8(VCC) U14.31(VDD(I2C-bus)) U15.8(VCC)
GND: C57.2 C58.2 C59.2 C60.2 DL6.C1 DL6.C2 R98.2 U13.2(A1) U13.3(A2) U13.4(GND) U13.7(WP) U14.25(VSS) U14.33(EP) U15.4(GND) U15.5(A2) U15.6(A1) U15.7(A0)
I2C_SCL: R95.1 TP13.1 U13.6(SCL) U14.29(SCL) U15.2(SCL) ; port I2C_SCL
I2C_SDA: R94.1 TP12.1 U13.5(SDA) U14.30(SDA) U15.1(SDA) ; port I2C_SDA
STATUS_IN_D1: U14.4(P0_3) ; port STATUS_IN_D1
STATUS_IN_D2: U14.3(P0_2) ; port STATUS_IN_D2
STATUS_IN_D3: U14.2(P0_1) ; port STATUS_IN_D3
STATUS_IN_D4: U14.1(P0_0) ; port STATUS_IN_D4
STATUS_OUT_H1_ERR: U14.21(P2_4) ; port STATUS_OUT_H1_ERR
STATUS_OUT_H1_OK: U14.22(P2_5) ; port STATUS_OUT_H1_OK
STATUS_OUT_H2_ERR: U14.19(P2_2) ; port STATUS_OUT_H2_ERR
STATUS_OUT_H2_OK: U14.20(P2_3) ; port STATUS_OUT_H2_OK
STATUS_OUT_H3_ERR: U14.17(P2_0) ; port STATUS_OUT_H3_ERR
STATUS_OUT_H3_OK: U14.18(P2_1) ; port STATUS_OUT_H3_OK
STATUS_OUT_L1_ERR: U14.11(P1_2) ; port STATUS_OUT_L1_ERR
STATUS_OUT_L1_OK: U14.12(P1_3) ; port STATUS_OUT_L1_OK
STATUS_OUT_L2_ERR: U14.9(P1_0) ; port STATUS_OUT_L2_ERR
STATUS_OUT_L2_OK: U14.10(P1_1) ; port STATUS_OUT_L2_OK
STATUS_OUT_L3_ERR: U14.7(P0_6) ; port STATUS_OUT_L3_ERR
STATUS_OUT_L3_OK: U14.8(P0_7) ; port STATUS_OUT_L3_OK
STATUS_OUT_L4_ERR: U14.5(P0_4) ; port STATUS_OUT_L4_ERR
STATUS_OUT_L4_OK: U14.6(P0_5) ; port STATUS_OUT_L4_OK
STATUS_OUT_M1_ERR: U14.15(P1_6) ; port STATUS_OUT_M1_ERR
STATUS_OUT_M1_OK: U14.16(P1_7) ; port STATUS_OUT_M1_OK
STATUS_OUT_M2_ERR: U14.13(P1_4) ; port STATUS_OUT_M2_ERR
STATUS_OUT_M2_OK: U14.14(P1_5) ; port STATUS_OUT_M2_OK
NetDL5_A: DL5.A R99.1
NetDL5_C: DL5.C TP16.1 U15.3(ALERT)
NetDL6_A1: DL6.A1 R101.1
NetDL6_A2: DL6.A2 R100.1
NetR96_1: R96.1 TP15.1 U14.32(~{INT})
NetR97_1: R97.1 TP14.1 U14.28(~{RESET})
NetR98_1: R98.1 U14.26(ADDR)
NetR100_2: R100.2 U14.24(P2_7)
NetR101_2: R101.2 U14.23(P2_6)

Not connected (* = marked no-connect by the designer): U13 1(NC)*

### Notes on the sheet
- I2C_PULL
- Addr: 0X50
- FRAM
- (near DL5) Warning_Temperature
- OUT_STATUS
- Addr: 0X22
- Addr: 0X18
- I2C ADDR:
  MB85RC04V   --> 0X50
  PI4IOE5V6416 --> 0X22
  MCP9808-E/MS --> 0X18
- TEMP_S
- (in symbol Title_Block) Page Contents:; NR DEVELOPMENTS; Size:; Revision:; Variant:; Date:; Sheet; of

### Library data of the parts
C57 C58 = CAP: as C2 on sheet PWR
C59 C60 = CAP: as C7 on sheet PWR
DL5 = LED_Red: Manufacturer: Wurth Elektronik; PartNumber: 150060RS75000; Case: 0603
DL6 = LED_Yellow_Blue: as DL4 on sheet CAN; PartNumber: 150141YB73100; Case: 3528
R94 R95 = Resistor: Manufacturer: Vishay; PartNumber: CRCW06034K70FKEB
R96 R97 = Resistor: Manufacturer: Vishay; PartNumber: CRCW060310K0FKEA
R98 = Resistor: Manufacturer: Vishay; PartNumber: CRCW06030000Z0EAC
R99 = Resistor: as R6 on sheet PWR
R100 R101 = Resistor: as R2 on sheet PWR
TP12-TP16 = Test_Point
U13 = MB85RC04V: F-RAM 4kbit FRAM, I2C, 3.0V 5.5V - SOP8 T&R; Manufacturer: Infineon Technologies; PartNumber: FM24CL16B-GTR
U14 = PCAL6524HEAZ: IC EXPANDER 24B 32HUQFN; Manufacturer: NXP Semiconductors; PartNumber: PCAL6524HEAZ; Case: HUQFN-32; Value: PCAL6524HEAZ
U15 = MCP9808-E/MS: + / - 0.5 degC Maximum Accuracy Digital Temperature Sensor, 400 uA, 2.7 to 5.5 V, -40 to 125 degC, 8-pin MSOP (MS8), Tube; Manufacturer: Microchip; PartNumber: MCP9808-E/MS; Case: MSOP-8; Value: MCP9808-E/MS